# Altium project Fall22 Universal PCB Rev.2.PrjPcb (part 1 of 2)
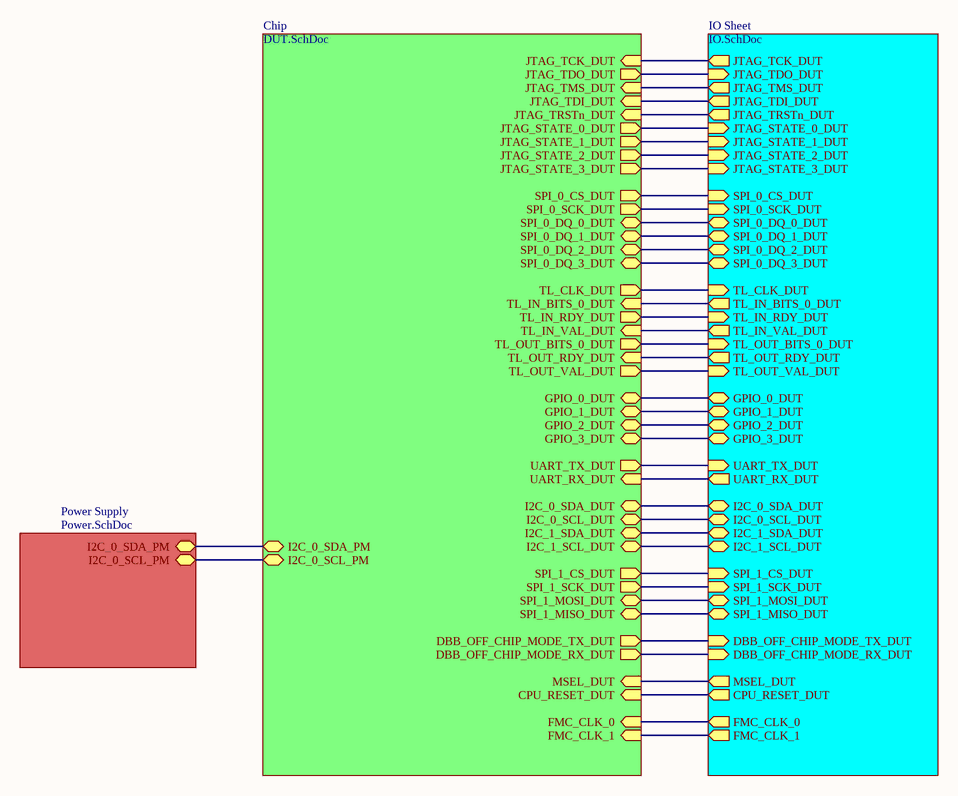
[diagram p0: Top.SchDoc]
4 sheets, 205 parts. Net scope: hierarchical (ports join the sheet entries above them; power ports are global).
Board file: PCB2.PcbDoc
Sheets:
  Top.SchDoc
    Chip = DUT.SchDoc
    Power Supply = Power.SchDoc
    IO Sheet = IO.SchDoc

## Sheet Top.SchDoc
size A

### Sub-sheets
Chip = DUT.SchDoc: JTAG_TCK_DUT (in), JTAG_TDO_DUT (out), JTAG_TMS_DUT (in), JTAG_TDI_DUT (in), JTAG_TRSTn_DUT (in), JTAG_STATE_0_DUT (out), JTAG_STATE_1_DUT (out), JTAG_STATE_2_DUT (out), JTAG_STATE_3_DUT (out), TL_CLK_DUT (out), SPI_0_CS_DUT (out), SPI_0_SCK_DUT (out), SPI_0_DQ_0_DUT (bidir), SPI_0_DQ_1_DUT (bidir), SPI_0_DQ_2_DUT (bidir), SPI_0_DQ_3_DUT (bidir), TL_IN_BITS_0_DUT (in), TL_IN_RDY_DUT (out), TL_IN_VAL_DUT (in), TL_OUT_BITS_0_DUT (out), TL_OUT_RDY_DUT (in), TL_OUT_VAL_DUT (out), GPIO_1_DUT (bidir), GPIO_0_DUT (bidir), GPIO_2_DUT (bidir), GPIO_3_DUT (bidir), UART_TX_DUT (out), UART_RX_DUT (in), I2C_0_SDA_DUT (bidir), I2C_0_SCL_DUT (bidir), I2C_1_SDA_DUT (bidir), I2C_1_SCL_DUT (bidir), SPI_1_CS_DUT (out), SPI_1_SCK_DUT (out), SPI_1_MOSI_DUT (bidir), SPI_1_MISO_DUT (bidir), DBB_OFF_CHIP_MODE_RX_DUT (out), DBB_OFF_CHIP_MODE_TX_DUT (out), I2C_0_SDA_PM (bidir), I2C_0_SCL_PM (bidir), MSEL_DUT (in), CPU_RESET_DUT (in), FMC_CLK_0 (in), FMC_CLK_1 (in)
IO Sheet = IO.SchDoc: JTAG_TCK_DUT (out), JTAG_TDO_DUT (in), JTAG_TMS_DUT (out), JTAG_TDI_DUT (out), JTAG_TRSTn_DUT (out), JTAG_STATE_0_DUT (in), JTAG_STATE_1_DUT (in), JTAG_STATE_2_DUT (in), JTAG_STATE_3_DUT (in), SPI_0_CS_DUT (in), SPI_0_SCK_DUT (in), SPI_0_DQ_0_DUT (bidir), SPI_0_DQ_1_DUT (bidir), SPI_0_DQ_2_DUT (bidir), SPI_0_DQ_3_DUT (bidir), TL_CLK_DUT (in), TL_IN_BITS_0_DUT (out), TL_IN_RDY_DUT (in), TL_IN_VAL_DUT (out), TL_OUT_BITS_0_DUT (in), TL_OUT_RDY_DUT (out), TL_OUT_VAL_DUT (in), GPIO_1_DUT (bidir), GPIO_0_DUT (bidir), GPIO_2_DUT (bidir), GPIO_3_DUT (bidir), UART_TX_DUT (in), UART_RX_DUT (out), I2C_0_SDA_DUT (bidir), I2C_0_SCL_DUT (bidir), I2C_1_SDA_DUT (bidir), I2C_1_SCL_DUT (bidir), SPI_1_CS_DUT (in), SPI_1_SCK_DUT (in), SPI_1_MOSI_DUT (bidir), SPI_1_MISO_DUT (bidir), DBB_OFF_CHIP_MODE_RX_DUT (in), DBB_OFF_CHIP_MODE_TX_DUT (in), MSEL_DUT (out), CPU_RESET_DUT (out), FMC_CLK_0 (out), FMC_CLK_1 (out)
Power Supply = Power.SchDoc: I2C_0_SDA_PM (bidir), I2C_0_SCL_PM (bidir)

### Nets
BOOT_SEL: sheet Chip/MSEL_DUT, sheet IO Sheet/MSEL_DUT
CPU_RESET: sheet Chip/CPU_RESET_DUT, sheet IO Sheet/CPU_RESET_DUT
DBB_OFF_CHIP_MODE_RX_DUT: sheet Chip/DBB_OFF_CHIP_MODE_RX_DUT, sheet IO Sheet/DBB_OFF_CHIP_MODE_RX_DUT
DBB_OFF_CHIP_MODE_TX_DUT: sheet Chip/DBB_OFF_CHIP_MODE_TX_DUT, sheet IO Sheet/DBB_OFF_CHIP_MODE_TX_DUT
GPIO_0: sheet Chip/GPIO_0_DUT, sheet IO Sheet/GPIO_0_DUT
GPIO_1: sheet Chip/GPIO_1_DUT, sheet IO Sheet/GPIO_1_DUT
GPIO_2: sheet Chip/GPIO_2_DUT, sheet IO Sheet/GPIO_2_DUT
GPIO_3: sheet Chip/GPIO_3_DUT, sheet IO Sheet/GPIO_3_DUT
I2C_0_SCL: sheet Chip/I2C_0_SCL_DUT, sheet IO Sheet/I2C_0_SCL_DUT
I2C_0_SCL_PM: sheet Chip/I2C_0_SCL_PM, sheet Power Supply/I2C_0_SCL_PM
I2C_0_SDA: sheet Chip/I2C_0_SDA_DUT, sheet IO Sheet/I2C_0_SDA_DUT
I2C_0_SDA_PM: sheet Chip/I2C_0_SDA_PM, sheet Power Supply/I2C_0_SDA_PM
I2C_1_SCL: sheet Chip/I2C_1_SCL_DUT, sheet IO Sheet/I2C_1_SCL_DUT
I2C_1_SDA: sheet Chip/I2C_1_SDA_DUT, sheet IO Sheet/I2C_1_SDA_DUT
JTAG_STATE_0: sheet Chip/JTAG_STATE_0_DUT, sheet IO Sheet/JTAG_STATE_0_DUT
JTAG_STATE_1: sheet Chip/JTAG_STATE_1_DUT, sheet IO Sheet/JTAG_STATE_1_DUT
JTAG_STATE_2: sheet Chip/JTAG_STATE_2_DUT, sheet IO Sheet/JTAG_STATE_2_DUT
JTAG_STATE_3: sheet Chip/JTAG_STATE_3_DUT, sheet IO Sheet/JTAG_STATE_3_DUT
JTAG_TCK: sheet Chip/JTAG_TCK_DUT, sheet IO Sheet/JTAG_TCK_DUT
JTAG_TDI: sheet Chip/JTAG_TDI_DUT, sheet IO Sheet/JTAG_TDI_DUT
JTAG_TDO: sheet Chip/JTAG_TDO_DUT, sheet IO Sheet/JTAG_TDO_DUT
JTAG_TMS: sheet Chip/JTAG_TMS_DUT, sheet IO Sheet/JTAG_TMS_DUT
JTAG_TRST: sheet Chip/JTAG_TRSTn_DUT, sheet IO Sheet/JTAG_TRSTn_DUT
SPI_0_CS: sheet Chip/SPI_0_CS_DUT, sheet IO Sheet/SPI_0_CS_DUT
SPI_0_DQ_0_DUT: sheet Chip/SPI_0_DQ_0_DUT, sheet IO Sheet/SPI_0_DQ_0_DUT
SPI_0_DQ_1_DUT: sheet Chip/SPI_0_DQ_1_DUT, sheet IO Sheet/SPI_0_DQ_1_DUT
SPI_0_DQ_2_DUT: sheet Chip/SPI_0_DQ_2_DUT, sheet IO Sheet/SPI_0_DQ_2_DUT
SPI_0_DQ_3_DUT: sheet Chip/SPI_0_DQ_3_DUT, sheet IO Sheet/SPI_0_DQ_3_DUT
SPI_0_SCK: sheet Chip/SPI_0_SCK_DUT, sheet IO Sheet/SPI_0_SCK_DUT
SPI_1_CS: sheet Chip/SPI_1_CS_DUT, sheet IO Sheet/SPI_1_CS_DUT
SPI_1_MISO: sheet Chip/SPI_1_MISO_DUT, sheet IO Sheet/SPI_1_MISO_DUT
SPI_1_MOSI: sheet Chip/SPI_1_MOSI_DUT, sheet IO Sheet/SPI_1_MOSI_DUT
SPI_1_SCK: sheet Chip/SPI_1_SCK_DUT, sheet IO Sheet/SPI_1_SCK_DUT
TL_CLK: sheet Chip/TL_CLK_DUT, sheet IO Sheet/TL_CLK_DUT
TL_IN_BITS_0_DUT: sheet Chip/TL_IN_BITS_0_DUT, sheet IO Sheet/TL_IN_BITS_0_DUT
TL_IN_RDY: sheet Chip/TL_IN_RDY_DUT, sheet IO Sheet/TL_IN_RDY_DUT
TL_IN_VAL: sheet Chip/TL_IN_VAL_DUT, sheet IO Sheet/TL_IN_VAL_DUT
TL_OUT_BITS_0_DUT: sheet Chip/TL_OUT_BITS_0_DUT, sheet IO Sheet/TL_OUT_BITS_0_DUT
TL_OUT_RDY: sheet Chip/TL_OUT_RDY_DUT, sheet IO Sheet/TL_OUT_RDY_DUT
TL_OUT_VAL: sheet Chip/TL_OUT_VAL_DUT, sheet IO Sheet/TL_OUT_VAL_DUT
UART_RX: sheet Chip/UART_RX_DUT, sheet IO Sheet/UART_RX_DUT
UART_TX: sheet Chip/UART_TX_DUT, sheet IO Sheet/UART_TX_DUT
NetH1_1: sheet Chip/FMC_CLK_1, sheet IO Sheet/FMC_CLK_1
NetH2_1: sheet Chip/FMC_CLK_0, sheet IO Sheet/FMC_CLK_0

## Sheet DUT.SchDoc
size A1; SPICEModelCacheEPBFKGZM: <root> / <DocumentId>EPBFKGZM</DocumentId> / </root>
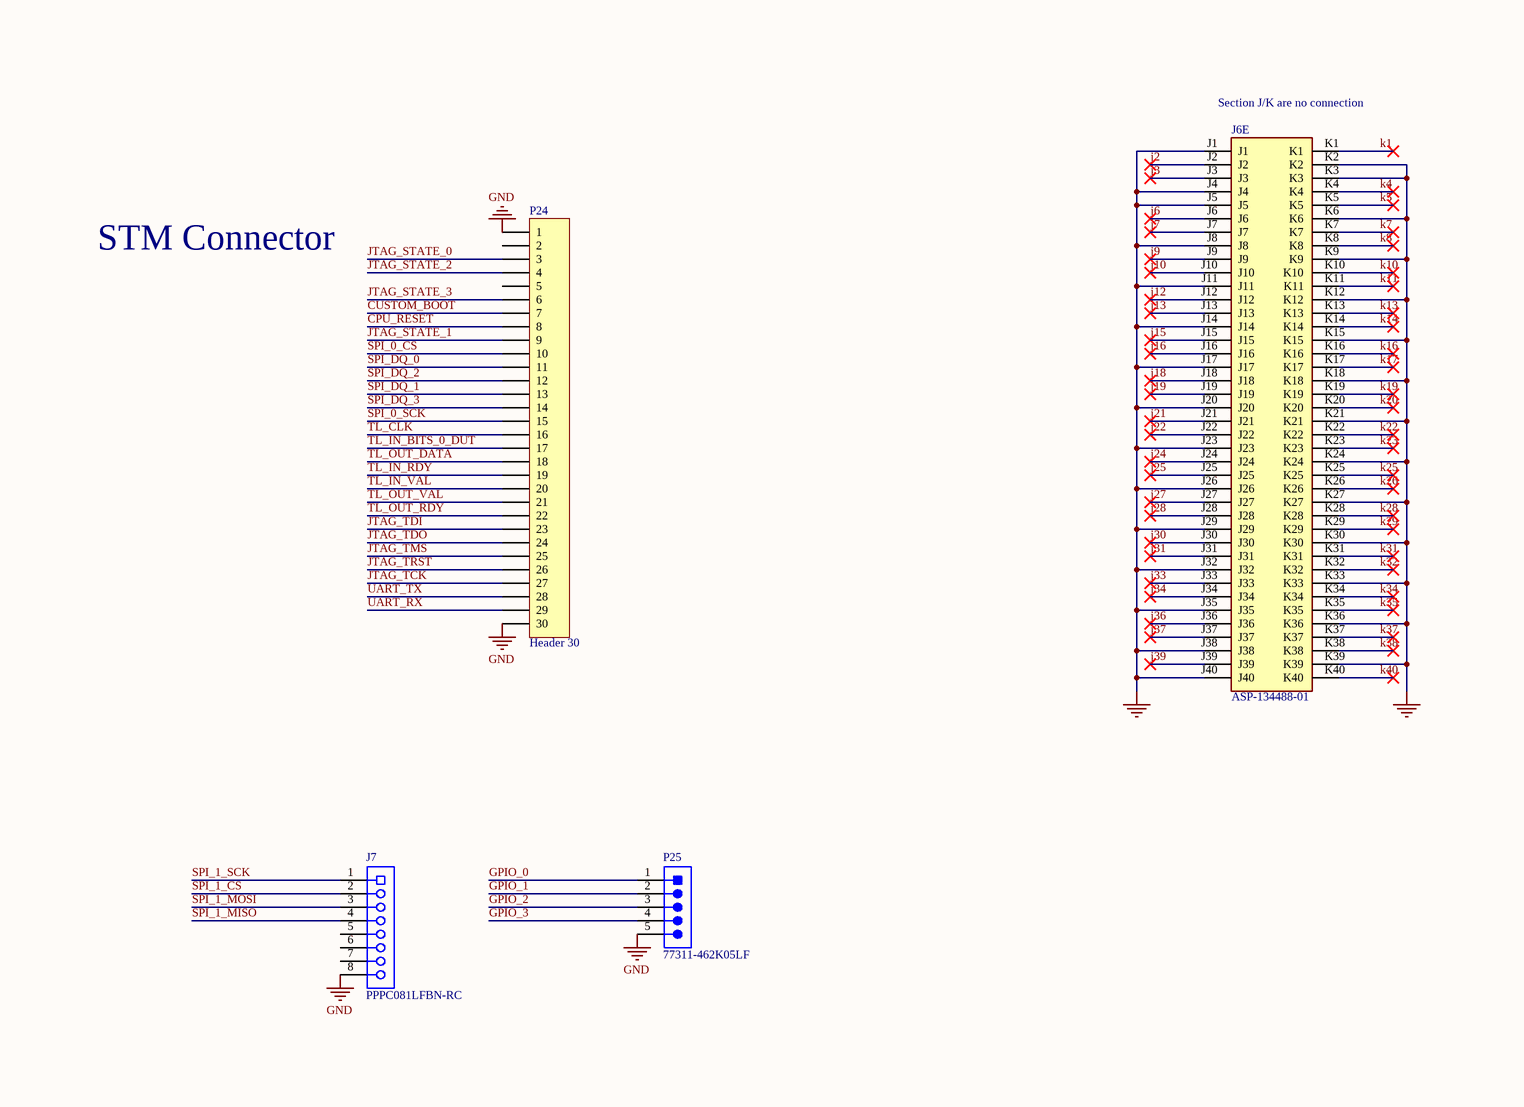
[diagram p1: DUT.SchDoc, centre left]
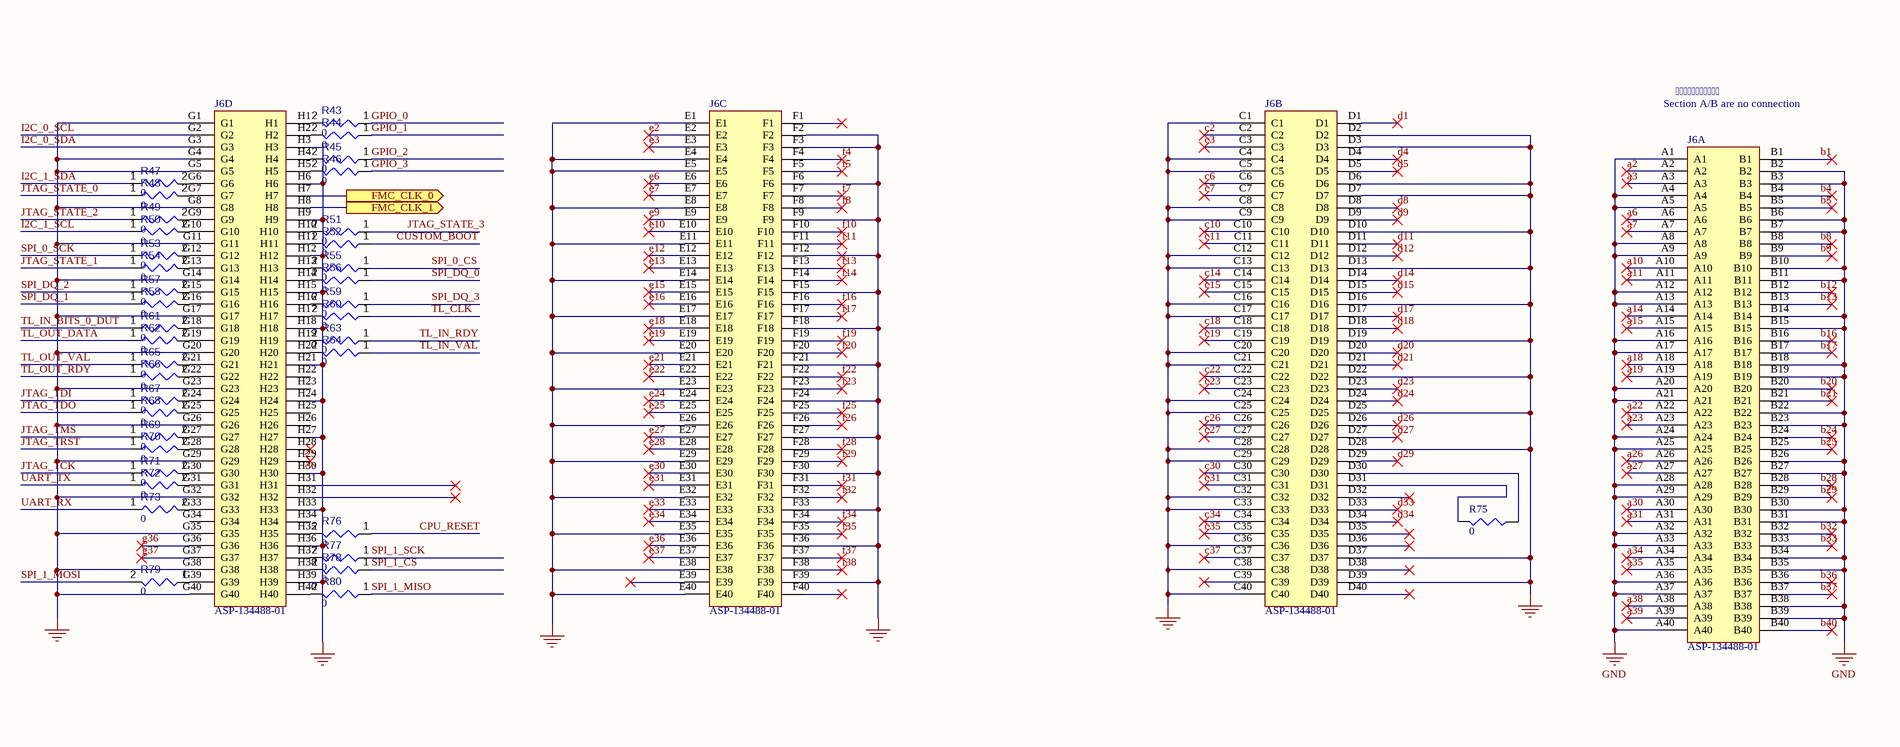
[diagram p2: DUT.SchDoc, centre right]
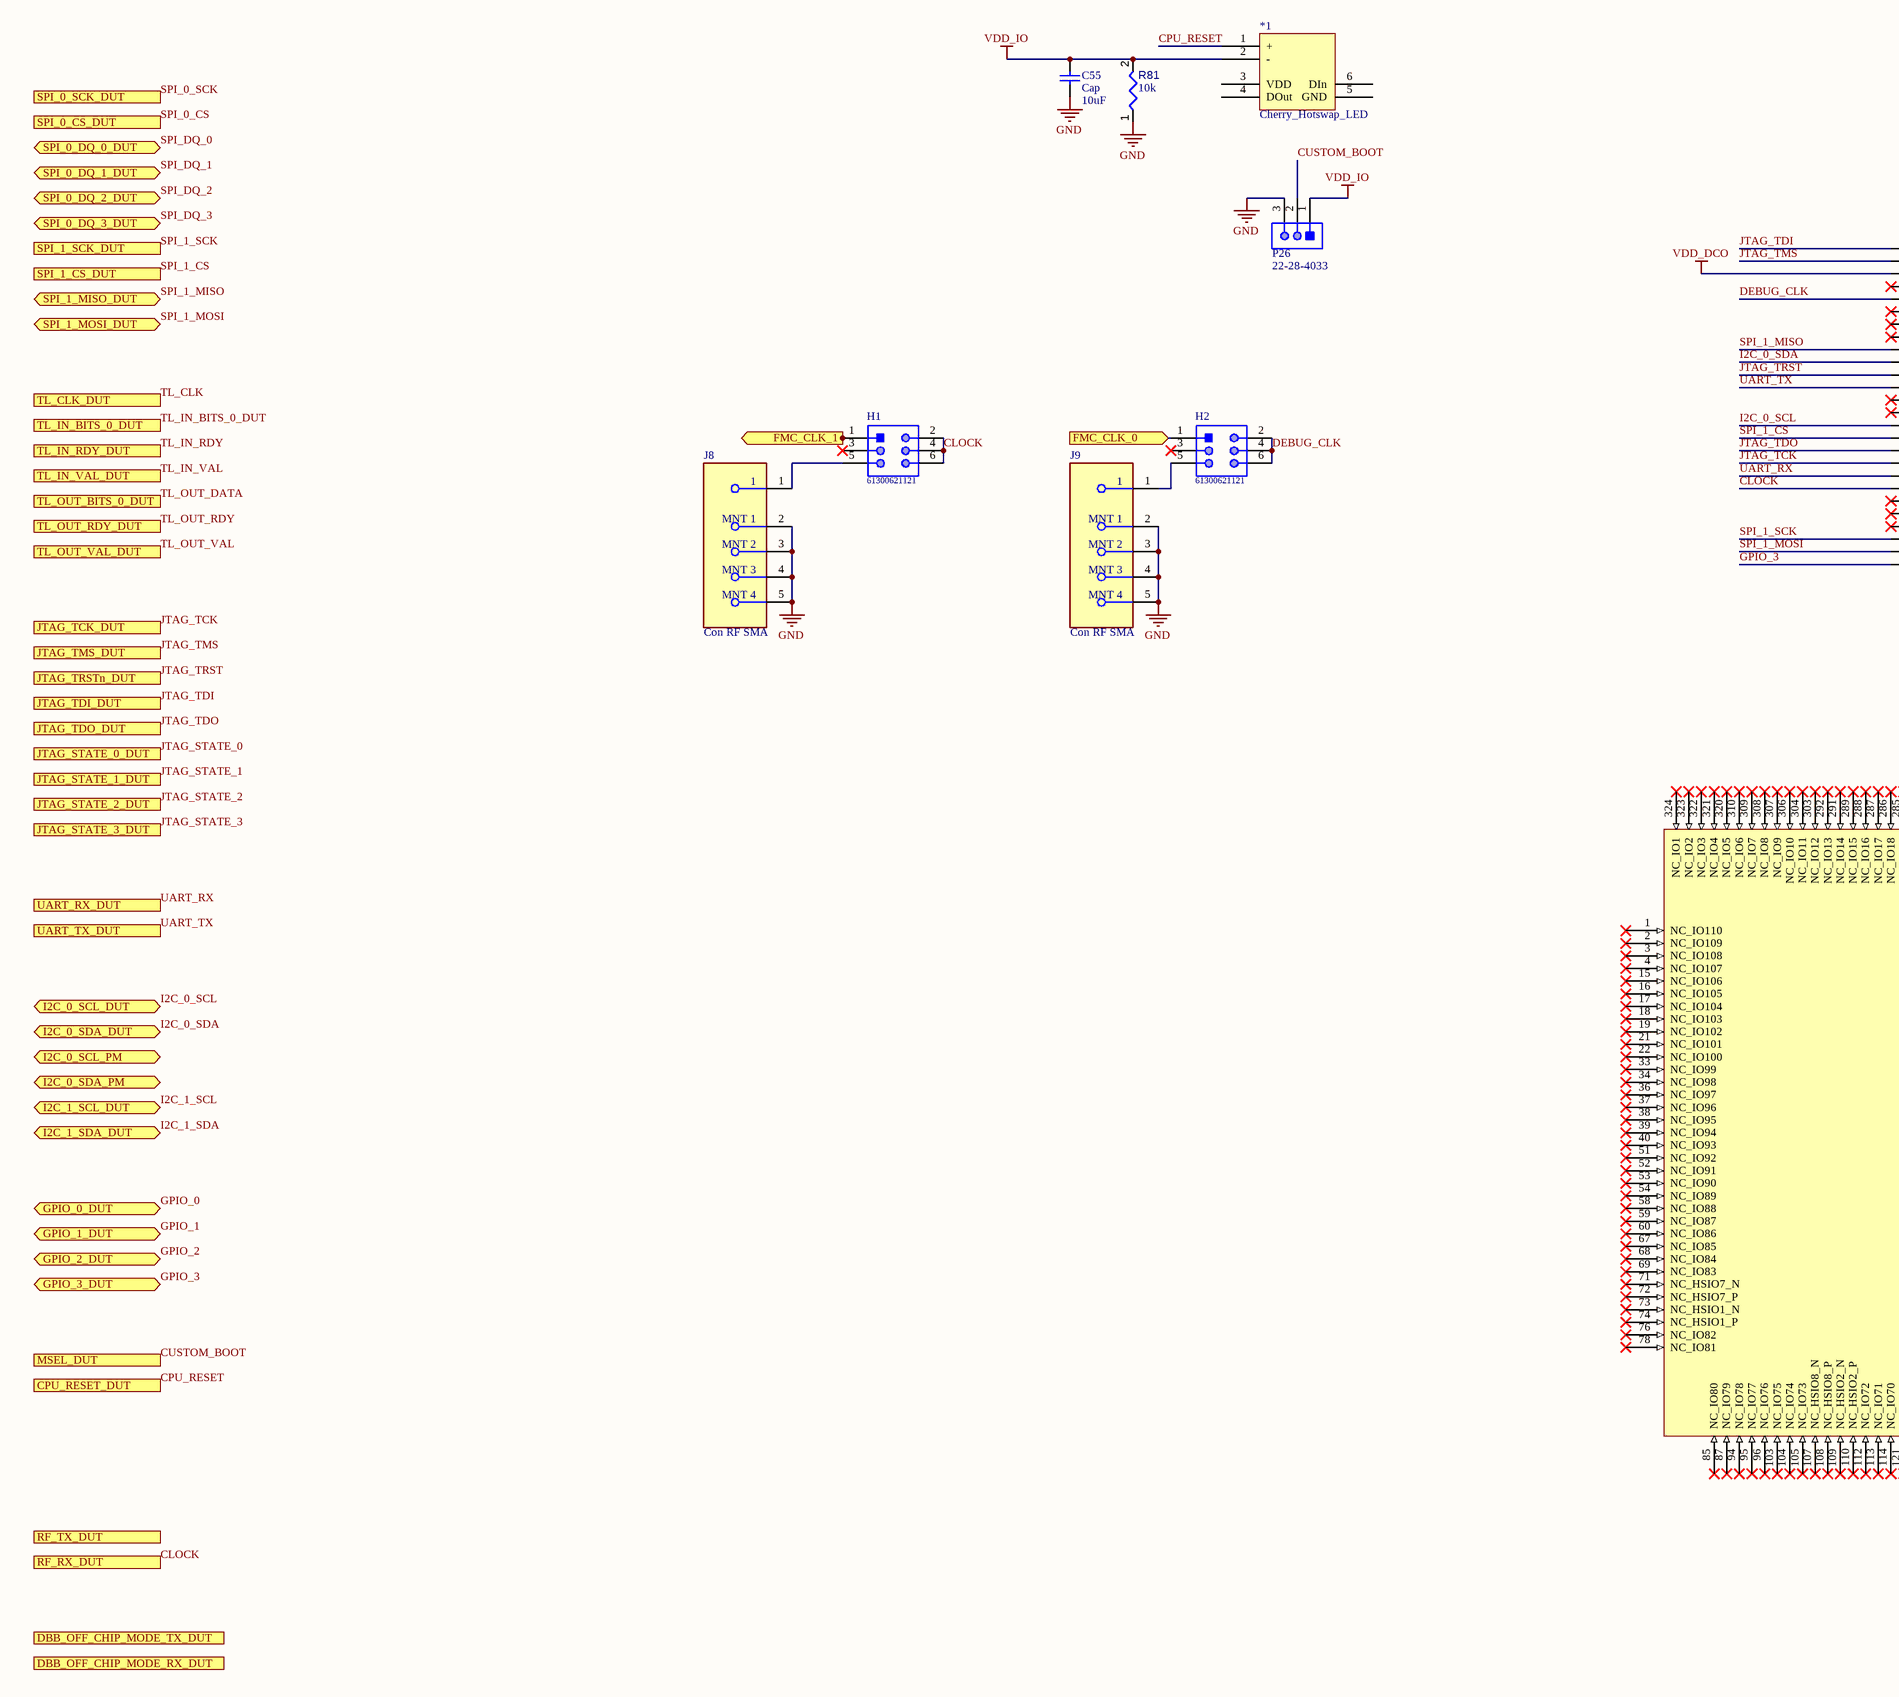
[diagram p3: DUT.SchDoc, bottom left]
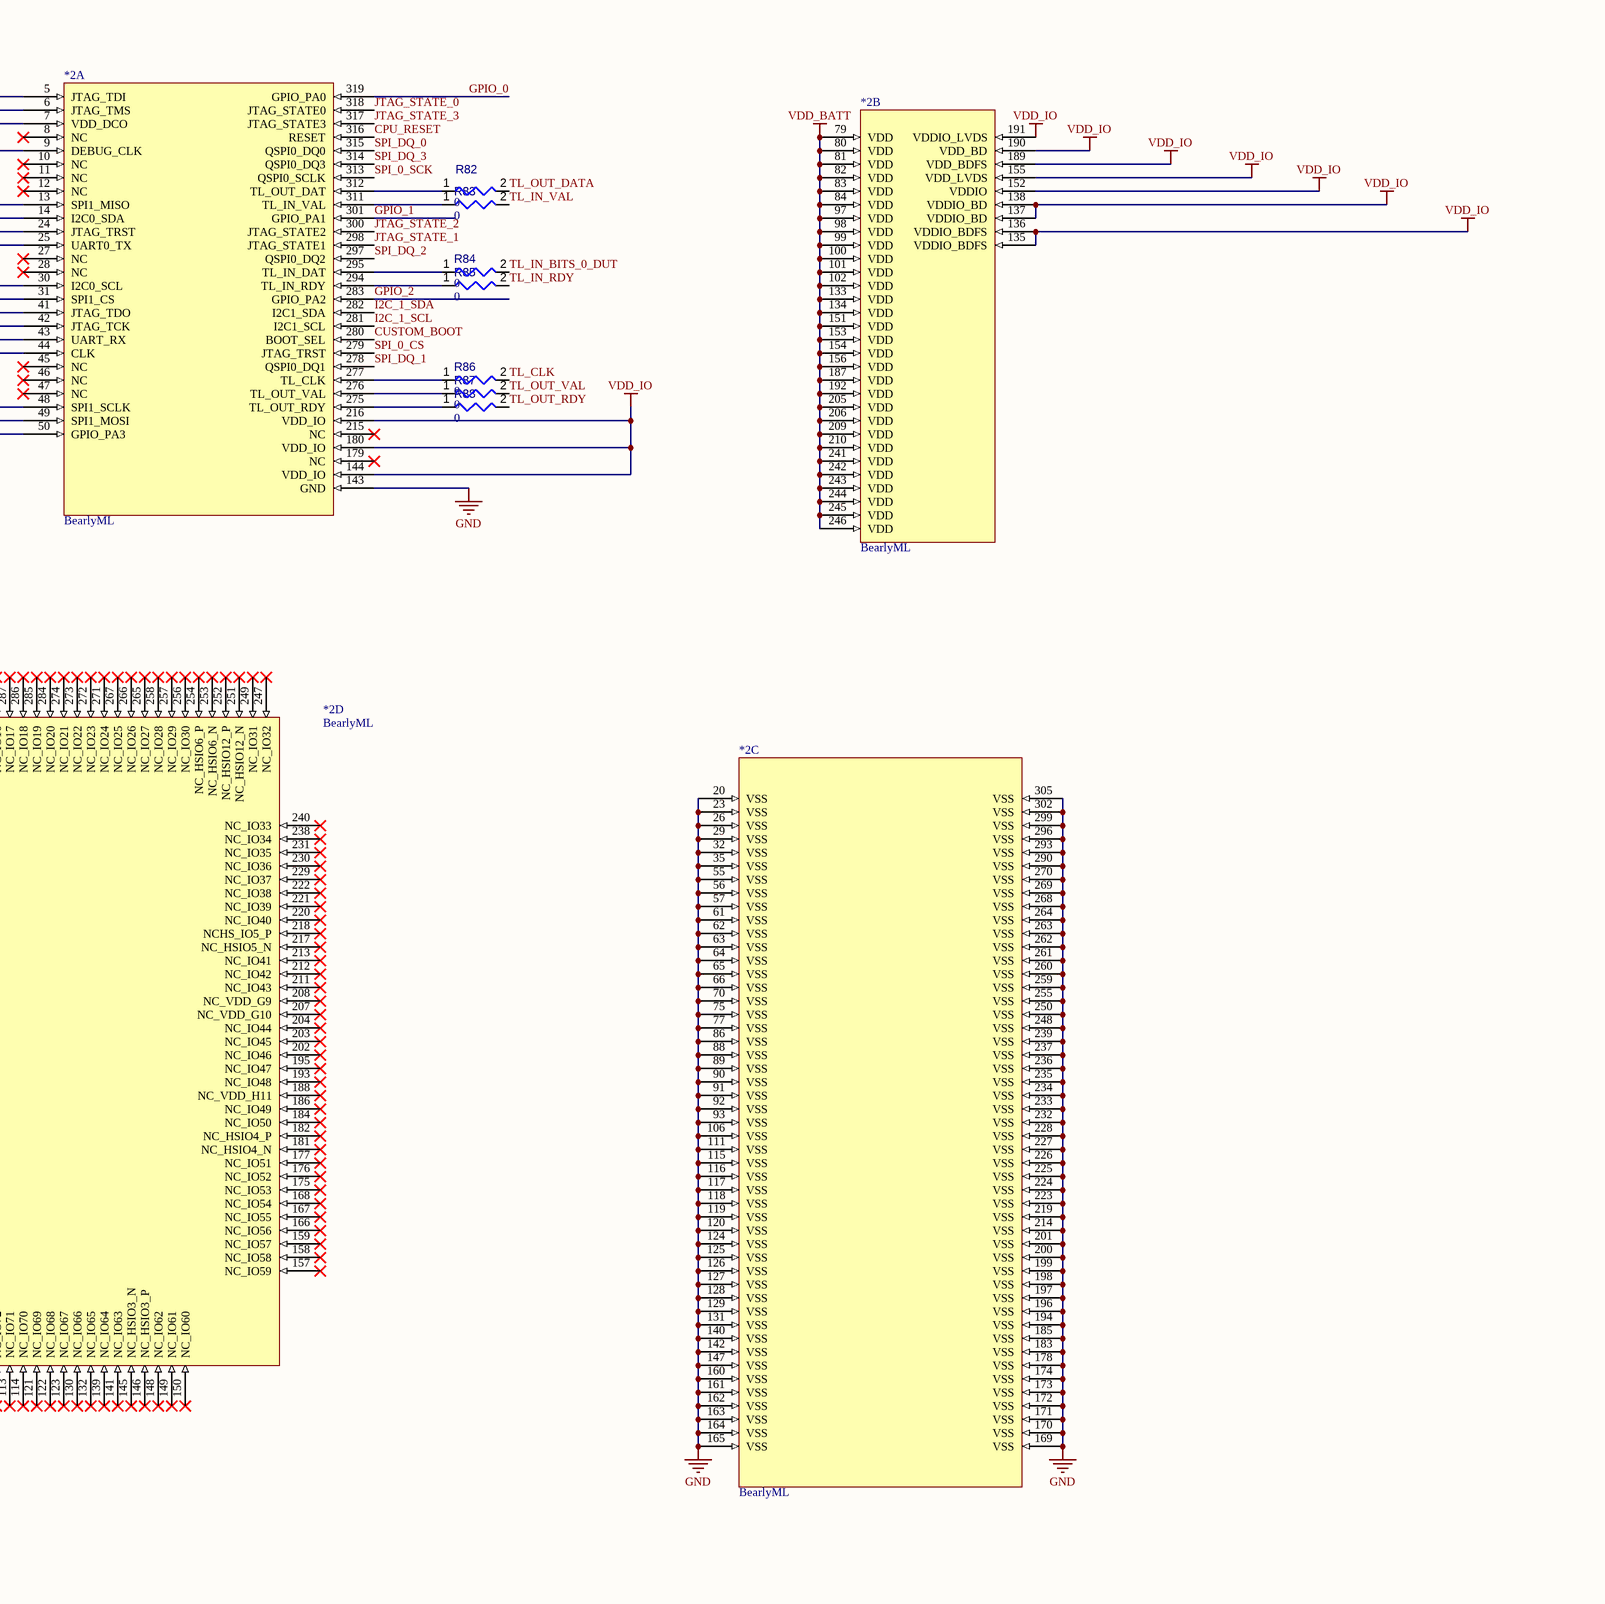
[diagram p4: DUT.SchDoc, bottom right]

### Parts
*1  Cherry_Hotswap_LED  [New footprint 1]
*2  BearlyML  [BGA324x18]  (parts A,B,C,D of 4)
C55  Cap  value 10uF  [0805]
H1  61300621121  [61300621121]
H2  61300621121  [61300621121]
J6  ASP-134488-01  [SAMTEC_ASP-134488-01]  (parts A,B,C,D,E of 5)
J7  PPPC081LFBN-RC  [SLIN-PPPC081LFBN-RC_V]
J8  Con RF SMA  [FP-RF2-04A-T-00-50-G-MFG]
J9  Con RF SMA  [FP-RF2-04A-T-00-50-G-MFG]
P24  Header 30  [HDR1X30]
P25  77311-462K05LF  [FCI-77311-5_V]
P26  22-28-4033  [MOLX-22-28-4033_V]
R43  value 0  [RESC0402(1005)_L]  (hidden comment: 0R2J)
R44  value 0  [RESC0402(1005)_L]  (hidden comment: 0R2J)
R45  value 0  [RESC0402(1005)_L]  (hidden comment: 0R2J)
R46  value 0  [RESC0402(1005)_L]  (hidden comment: 0R2J)
R47  value 0  [RESC0402(1005)_L]  (hidden comment: 0R2J)
R48  value 0  [RESC0402(1005)_L]  (hidden comment: 0R2J)
R49  value 0  [RESC0402(1005)_L]  (hidden comment: 0R2J)
R50  value 0  [RESC0402(1005)_L]  (hidden comment: 0R2J)
R51  value 0  [RESC0402(1005)_L]  (hidden comment: 0R2J)
R52  value 0  [RESC0402(1005)_L]  (hidden comment: 0R2J)
R53  value 0  [RESC0402(1005)_L]  (hidden comment: 0R2J)
R54  value 0  [RESC0402(1005)_L]  (hidden comment: 0R2J)
R55  value 0  [RESC0402(1005)_L]  (hidden comment: 0R2J)
R56  value 0  [RESC0402(1005)_L]  (hidden comment: 0R2J)
R57  value 0  [RESC0402(1005)_L]  (hidden comment: 0R2J)
R58  value 0  [RESC0402(1005)_L]  (hidden comment: 0R2J)
R59  value 0  [RESC0402(1005)_L]  (hidden comment: 0R2J)
R60  value 0  [RESC0402(1005)_L]  (hidden comment: 0R2J)
R61  value 0  [RESC0402(1005)_L]  (hidden comment: 0R2J)
R62  value 0  [RESC0402(1005)_L]  (hidden comment: 0R2J)
R63  value 0  [RESC0402(1005)_L]  (hidden comment: 0R2J)
R64  value 0  [RESC0402(1005)_L]  (hidden comment: 0R2J)
R65  value 0  [RESC0402(1005)_L]  (hidden comment: 0R2J)
R66  value 0  [RESC0402(1005)_L]  (hidden comment: 0R2J)
R67  value 0  [RESC0402(1005)_L]  (hidden comment: 0R2J)
R68  value 0  [RESC0402(1005)_L]  (hidden comment: 0R2J)
R69  value 0  [RESC0402(1005)_L]  (hidden comment: 0R2J)
R70  value 0  [RESC0402(1005)_L]  (hidden comment: 0R2J)
R71  value 0  [RESC0402(1005)_L]  (hidden comment: 0R2J)
R72  value 0  [RESC0402(1005)_L]  (hidden comment: 0R2J)
R73  value 0  [RESC0402(1005)_L]  (hidden comment: 0R2J)
R75  0  [0603]
R76  value 0  [RESC0402(1005)_L]  (hidden comment: 0R2J)
R77  value 0  [RESC0402(1005)_L]  (hidden comment: 0R2J)
R78  value 0  [RESC0402(1005)_L]  (hidden comment: 0R2J)
R79  value 0  [RESC0402(1005)_L]  (hidden comment: 0R2J)
R80  value 0  [RESC0402(1005)_L]  (hidden comment: 0R2J)
R81  value 10k  [RESC1608X55X25ML10T15]  (hidden comment: Resistor 10k +/-1% 0603 100 mW)
R82  value 0  [RESC0402(1005)_L]  (hidden comment: 0R2J)
R83  value 0  [RESC0402(1005)_L]  (hidden comment: 0R2J)
R84  value 0  [RESC0402(1005)_L]  (hidden comment: 0R2J)
R85  value 0  [RESC0402(1005)_L]  (hidden comment: 0R2J)
R86  value 0  [RESC0402(1005)_L]  (hidden comment: 0R2J)
R87  value 0  [RESC0402(1005)_L]  (hidden comment: 0R2J)
R88  value 0  [RESC0402(1005)_L]  (hidden comment: 0R2J)

### Ports
CPU_RESET_DUT (in), DBB_OFF_CHIP_MODE_RX_DUT (out), DBB_OFF_CHIP_MODE_TX_DUT (out), FMC_CLK_0 (in), FMC_CLK_0 (out), FMC_CLK_1 (out), GPIO_0_DUT (bidir), GPIO_1_DUT (bidir), GPIO_2_DUT (bidir), GPIO_3_DUT (bidir), I2C_0_SCL_DUT (bidir), I2C_0_SCL_PM (bidir), I2C_0_SDA_DUT (bidir), I2C_0_SDA_PM (bidir), I2C_1_SCL_DUT (bidir), I2C_1_SDA_DUT (bidir), JTAG_STATE_0_DUT (out), JTAG_STATE_1_DUT (out), JTAG_STATE_2_DUT (out), JTAG_STATE_3_DUT (out), JTAG_TCK_DUT (in), JTAG_TDI_DUT (in), JTAG_TDO_DUT (out), JTAG_TMS_DUT (in), JTAG_TRSTn_DUT (in), MSEL_DUT (out), RF_RX_DUT (in), RF_TX_DUT (out), SPI_0_CS_DUT (out), SPI_0_DQ_0_DUT (bidir), SPI_0_DQ_1_DUT (bidir), SPI_0_DQ_2_DUT (bidir), SPI_0_DQ_3_DUT (bidir), SPI_0_SCK_DUT (out), SPI_1_CS_DUT (out), SPI_1_MISO_DUT (bidir), SPI_1_MOSI_DUT (bidir), SPI_1_SCK_DUT (out), TL_CLK_DUT (out), TL_IN_BITS_0_DUT (in), TL_IN_RDY_DUT (out), TL_IN_VAL_DUT (in), TL_OUT_BITS_0_DUT (out), TL_OUT_RDY_DUT (in), TL_OUT_VAL_DUT (out), UART_RX_DUT (in), UART_TX_DUT (out)

### Nets
GND: *2.20(VSS) *2.23(VSS) *2.26(VSS) *2.29(VSS) *2.32(VSS) *2.35(VSS) *2.55(VSS) *2.56(VSS) *2.57(VSS) *2.61(VSS) *2.62(VSS) *2.63(VSS) *2.64(VSS) *2.65(VSS) *2.66(VSS) *2.70(VSS) *2.75(VSS) *2.77(VSS) *2.86(VSS) *2.88(VSS) *2.89(VSS) *2.90(VSS) *2.91(VSS) *2.92(VSS) *2.93(VSS) *2.106(VSS) *2.111(VSS) *2.115(VSS) *2.116(VSS) *2.117(VSS) *2.118(VSS) *2.119(VSS) *2.120(VSS) *2.124(VSS) *2.125(VSS) *2.126(VSS) *2.127(VSS) *2.128(VSS) *2.129(VSS) *2.131(VSS) *2.140(VSS) *2.142(VSS) *2.143(GND) *2.147(VSS) *2.160(VSS) *2.161(VSS) *2.162(VSS) *2.163(VSS) *2.164(VSS) *2.165(VSS) *2.169(VSS) *2.170(VSS) *2.171(VSS) *2.172(VSS) *2.173(VSS) *2.174(VSS) *2.178(VSS) *2.183(VSS) *2.185(VSS) *2.194(VSS) *2.196(VSS) *2.197(VSS) *2.198(VSS) *2.199(VSS) *2.200(VSS) *2.201(VSS) *2.214(VSS) *2.219(VSS) *2.223(VSS) *2.224(VSS) *2.225(VSS) *2.226(VSS) *2.227(VSS) *2.228(VSS) *2.232(VSS) *2.233(VSS) *2.234(VSS) *2.235(VSS) *2.236(VSS) *2.237(VSS) *2.239(VSS) *2.248(VSS) *2.250(VSS) *2.255(VSS) *2.259(VSS) *2.260(VSS) *2.261(VSS) *2.262(VSS) *2.263(VSS) *2.264(VSS) *2.268(VSS) *2.269(VSS) *2.270(VSS) *2.290(VSS) *2.293(VSS) *2.296(VSS) *2.299(VSS) *2.302(VSS) *2.305(VSS) C55.1 J6.A1 J6.A4 J6.A5 J6.A8 J6.A9 J6.A12 J6.A13 J6.A16 J6.A17 J6.A20 J6.A21 J6.A24 J6.A25 J6.A28 J6.A29 J6.A32 J6.A33 J6.A36 J6.A37 J6.A40 J6.B2 J6.B3 J6.B6 J6.B7 J6.B10 J6.B11 J6.B14 J6.B15 J6.B18 J6.B19 J6.B22 J6.B23 J6.B26 J6.B27 J6.B30 J6.B31 J6.B34 J6.B35 J6.B38 J6.B39 J6.C1 J6.C4 J6.C5 J6.C8 J6.C9 J6.C12 J6.C13 J6.C16 J6.C17 J6.C20 J6.C21 J6.C24 J6.C25 J6.C28 J6.C29 J6.C32 J6.C33 J6.C36 J6.C38 J6.C40 J6.D2 J6.D3 J6.D6 J6.D7 J6.D10 J6.D13 J6.D16 J6.D19 J6.D22 J6.D25 J6.D28 J6.D37 J6.D39 J6.E1 J6.E4 J6.E5 J6.E8 J6.E11 J6.E14 J6.E17 J6.E20 J6.E23 J6.E26 J6.E29 J6.E32 J6.E35 J6.E38 J6.E40 J6.F2 J6.F3 J6.F6 J6.F9 J6.F12 J6.F15 J6.F18 J6.F21 J6.F24 J6.F27 J6.F30 J6.F33 J6.F36 J6.F39 J6.G1 J6.G4 J6.G5 J6.G8 J6.G11 J6.G14 J6.G17 J6.G20 J6.G23 J6.G26 J6.G29 J6.G32 J6.G35 J6.G38 J6.G40 J6.H3 J6.H6 J6.H9 J6.H12 J6.H15 J6.H18 J6.H21 J6.H24 J6.H27 J6.H30 J6.H33 J6.H36 J6.H39 J6.J1 J6.J4 J6.J5 J6.J8 J6.J11 J6.J14 J6.J17 J6.J20 J6.J23 J6.J26 J6.J29 J6.J32 J6.J35 J6.J38 J6.J40 J6.K2 J6.K3 J6.K6 J6.K9 J6.K12 J6.K15 J6.K18 J6.K21 J6.K24 J6.K27 J6.K30 J6.K33 J6.K36 J6.K39 J7.8 J8.2(MNT_1) J8.3(MNT_2) J8.4(MNT_3) J8.5(MNT_4) J9.2(MNT_1) J9.3(MNT_2) J9.4(MNT_3) J9.5(MNT_4) P24.1 P24.30 P25.5(CTS) P26.3 R81.1
VDD_BATT: *2.79(VDD) *2.80(VDD) *2.81(VDD) *2.82(VDD) *2.83(VDD) *2.84(VDD) *2.97(VDD) *2.98(VDD) *2.99(VDD) *2.100(VDD) *2.101(VDD) *2.102(VDD) *2.133(VDD) *2.134(VDD) *2.151(VDD) *2.153(VDD) *2.154(VDD) *2.156(VDD) *2.187(VDD) *2.192(VDD) *2.205(VDD) *2.206(VDD) *2.209(VDD) *2.210(VDD) *2.241(VDD) *2.242(VDD) *2.243(VDD) *2.244(VDD) *2.245(VDD) *2.246(VDD)
VDD_DCO: *2.7(VDD_DCO)
VDD_IO: *1.2(-) *2.135(VDDIO_BDFS) *2.136(VDDIO_BDFS) *2.137(VDDIO_BD) *2.138(VDDIO_BD) *2.144(VDD_IO) *2.152(VDDIO) *2.155(VDD_LVDS) *2.180(VDD_IO) *2.189(VDD_BDFS) *2.190(VDD_BD) *2.191(VDDIO_LVDS) *2.216(VDD_IO) C55.2 P26.1 R81.2  [project net 1V8_DUT]
a2: J6.A2
a3: J6.A3
a6: J6.A6
a7: J6.A7
a10: J6.A10
a11: J6.A11
a14: J6.A14
a15: J6.A15
a18: J6.A18
a19: J6.A19
a22: J6.A22
a23: J6.A23
a26: J6.A26
a27: J6.A27
a30: J6.A30
a31: J6.A31
a34: J6.A34
a35: J6.A35
a38: J6.A38
a39: J6.A39
b1: J6.B1
b4: J6.B4
b5: J6.B5
b8: J6.B8
b9: J6.B9
b12: J6.B12
b13: J6.B13
b16: J6.B16
b17: J6.B17
b20: J6.B20
b21: J6.B21
b24: J6.B24
b25: J6.B25
b28: J6.B28
b29: J6.B29
b32: J6.B32
b33: J6.B33
b36: J6.B36
b37: J6.B37
b40: J6.B40
c2: J6.C2
c3: J6.C3
c6: J6.C6
c7: J6.C7
c10: J6.C10
c11: J6.C11
c14: J6.C14
c15: J6.C15
c18: J6.C18
c19: J6.C19
c22: J6.C22
c23: J6.C23
c26: J6.C26
c27: J6.C27
c30: J6.C30
c31: J6.C31
c34: J6.C34
c35: J6.C35
c37: J6.C37
CLOCK: *2.44(CLK) H1.2 H1.4 H1.6 ; port RF_RX_DUT
CPU_RESET: *1.1(+) *2.316(RESET) P24.8 R76.1 ; port CPU_RESET_DUT
CUSTOM_BOOT: *2.280(BOOT_SEL) P24.7 P26.2 R52.1 ; port MSEL_DUT  [project net BOOT_SEL]
d1: J6.D1
d4: J6.D4
d5: J6.D5
d8: J6.D8
d9: J6.D9
d11: J6.D11
d12: J6.D12
d14: J6.D14
d15: J6.D15
d17: J6.D17
d18: J6.D18
d20: J6.D20
d21: J6.D21
d23: J6.D23
d24: J6.D24
d26: J6.D26
d27: J6.D27
d29: J6.D29
d33: J6.D33
d34: J6.D34
DEBUG_CLK: *2.9(DEBUG_CLK) H2.2 H2.4 H2.6
e2: J6.E2
e3: J6.E3
e6: J6.E6
e7: J6.E7
e9: J6.E9
e10: J6.E10
e12: J6.E12
e13: J6.E13
e15: J6.E15
e16: J6.E16
e18: J6.E18
e19: J6.E19
e21: J6.E21
e22: J6.E22
e24: J6.E24
e25: J6.E25
e27: J6.E27
e28: J6.E28
e30: J6.E30
e31: J6.E31
e33: J6.E33
e34: J6.E34
e36: J6.E36
e37: J6.E37
f4: J6.F4
f5: J6.F5
f7: J6.F7
f8: J6.F8
f10: J6.F10
f11: J6.F11
f13: J6.F13
f14: J6.F14
f16: J6.F16
f17: J6.F17
f19: J6.F19
f20: J6.F20
f22: J6.F22
f23: J6.F23
f25: J6.F25
f26: J6.F26
f28: J6.F28
f29: J6.F29
f31: J6.F31
f32: J6.F32
f34: J6.F34
f35: J6.F35
f37: J6.F37
f38: J6.F38
g36: J6.G36
g37: J6.G37
GPIO_0: *2.319(GPIO_PA0) P25.1(DTR) R43.1 ; port GPIO_0_DUT
GPIO_1: *2.301(GPIO_PA1) P25.2(RXI) R44.1 ; port GPIO_1_DUT
GPIO_2: *2.283(GPIO_PA2) P25.3(TXO) R45.1 ; port GPIO_2_DUT
GPIO_3: *2.50(GPIO_PA3) P25.4(VCC) R46.1 ; port GPIO_3_DUT
I2C_0_SCL: *2.30(I2C0_SCL) J6.G2 ; port I2C_0_SCL_DUT
I2C_0_SDA: *2.14(I2C0_SDA) J6.G3 ; port I2C_0_SDA_DUT
I2C_1_SCL: *2.281(I2C1_SCL) R50.1 ; port I2C_1_SCL_DUT
I2C_1_SDA: *2.282(I2C1_SDA) R47.1 ; port I2C_1_SDA_DUT
j2: J6.J2
j3: J6.J3
j6: J6.J6
j7: J6.J7
j9: J6.J9
j10: J6.J10
j12: J6.J12
j13: J6.J13
j15: J6.J15
j16: J6.J16
j18: J6.J18
j19: J6.J19
j21: J6.J21
j22: J6.J22
j24: J6.J24
j25: J6.J25
j27: J6.J27
j28: J6.J28
j30: J6.J30
j31: J6.J31
j33: J6.J33
j34: J6.J34
j36: J6.J36
j37: J6.J37
j39: J6.J39
JTAG_STATE_0: *2.318(JTAG_STATE0) P24.3 R48.1 ; port JTAG_STATE_0_DUT
JTAG_STATE_1: *2.298(JTAG_STATE1) P24.9 R54.1 ; port JTAG_STATE_1_DUT
JTAG_STATE_2: *2.300(JTAG_STATE2) P24.4 R49.1 ; port JTAG_STATE_2_DUT
JTAG_STATE_3: *2.317(JTAG_STATE3) P24.6 R51.1 ; port JTAG_STATE_3_DUT
JTAG_TCK: *2.42(JTAG_TCK) P24.27 R71.1 ; port JTAG_TCK_DUT
JTAG_TDI: *2.5(JTAG_TDI) P24.23 R67.1 ; port JTAG_TDI_DUT
JTAG_TDO: *2.41(JTAG_TDO) P24.24 R68.1 ; port JTAG_TDO_DUT
JTAG_TMS: *2.6(JTAG_TMS) P24.25 R69.1 ; port JTAG_TMS_DUT
JTAG_TRST: *2.24(JTAG_TRST) P24.26 R70.1 ; port JTAG_TRSTn_DUT
k1: J6.K1
k4: J6.K4
k5: J6.K5
k7: J6.K7
k8: J6.K8
k10: J6.K10
k11: J6.K11
k13: J6.K13
k14: J6.K14
k16: J6.K16
k17: J6.K17
k19: J6.K19
k20: J6.K20
k22: J6.K22
k23: J6.K23
k25: J6.K25
k26: J6.K26
k28: J6.K28
k29: J6.K29
k31: J6.K31
k32: J6.K32
k34: J6.K34
k35: J6.K35
k37: J6.K37
k38: J6.K38
k40: J6.K40
SPI_0_CS: *2.279(JTAG_TRST) P24.10 R55.1 ; port SPI_0_CS_DUT
SPI_0_SCK: *2.313(QSPI0_SCLK) P24.15 R53.1 ; port SPI_0_SCK_DUT
SPI_1_CS: *2.31(SPI1_CS) J7.2 R78.1 ; port SPI_1_CS_DUT
SPI_1_MISO: *2.13(SPI1_MISO) J7.4 R80.1 ; port SPI_1_MISO_DUT
SPI_1_MOSI: *2.49(SPI1_MOSI) J7.3 R79.2 ; port SPI_1_MOSI_DUT
SPI_1_SCK: *2.48(SPI1_SCLK) J7.1 R77.1 ; port SPI_1_SCK_DUT
SPI_DQ_0: *2.315(QSPI0_DQ0) P24.11 R56.1 ; port SPI_0_DQ_0_DUT  [project net SPI_0_DQ_0_DUT]
SPI_DQ_1: *2.278(QSPI0_DQ1) P24.13 R58.1 ; port SPI_0_DQ_1_DUT  [project net SPI_0_DQ_1_DUT]
SPI_DQ_2: *2.297(QSPI0_DQ2) P24.12 R57.1 ; port SPI_0_DQ_2_DUT  [project net SPI_0_DQ_2_DUT]
SPI_DQ_3: *2.314(QSPI0_DQ3) P24.14 R59.1 ; port SPI_0_DQ_3_DUT  [project net SPI_0_DQ_3_DUT]
TL_CLK: P24.16 R60.1 R86.2 ; port TL_CLK_DUT
TL_IN_BITS_0_DUT: P24.17 R61.1 R84.2 ; port TL_IN_BITS_0_DUT
TL_IN_RDY: P24.19 R63.1 R85.2 ; port TL_IN_RDY_DUT
TL_IN_VAL: P24.20 R64.1 R83.2 ; port TL_IN_VAL_DUT
TL_OUT_DATA: P24.18 R62.1 R82.2 ; port TL_OUT_BITS_0_DUT  [project net TL_OUT_BITS_0_DUT]
TL_OUT_RDY: P24.22 R66.1 R88.2 ; port TL_OUT_RDY_DUT
TL_OUT_VAL: P24.21 R65.1 R87.2 ; port TL_OUT_VAL_DUT
UART_RX: *2.43(UART_RX) P24.29 R73.1 ; port UART_RX_DUT
UART_TX: *2.25(UART0_TX) P24.28 R72.1 ; port UART_TX_DUT
Net*2_275: *2.275(TL_OUT_RDY) R88.1
Net*2_276: *2.276(TL_OUT_VAL) R87.1
Net*2_277: *2.277(TL_CLK) R86.1
Net*2_294: *2.294(TL_IN_RDY) R85.1
Net*2_295: *2.295(TL_IN_DAT) R84.1
Net*2_311: *2.311(TL_IN_VAL) R83.1
Net*2_312: *2.312(TL_OUT_DAT) R82.1
NetH1_1: H1.1 J6.H8 ; port FMC_CLK_1
NetH1_5: H1.5 J8.1
NetH2_1: H2.1 J6.H7 ; port FMC_CLK_0
NetH2_5: H2.5 J9.1
NetJ6_D30: J6.D30 R75.2
NetJ6_D31: J6.D31 R75.1
NetJ6_G6: J6.G6 R47.2
NetJ6_G7: J6.G7 R48.2
NetJ6_G9: J6.G9 R49.2
NetJ6_G10: J6.G10 R50.2
NetJ6_G12: J6.G12 R53.2
NetJ6_G13: J6.G13 R54.2
NetJ6_G15: J6.G15 R57.2
NetJ6_G16: J6.G16 R58.2
NetJ6_G18: J6.G18 R61.2
NetJ6_G19: J6.G19 R62.2
NetJ6_G21: J6.G21 R65.2
NetJ6_G22: J6.G22 R66.2
NetJ6_G24: J6.G24 R67.2
NetJ6_G25: J6.G25 R68.2
NetJ6_G27: J6.G27 R69.2
NetJ6_G28: J6.G28 R70.2
NetJ6_G30: J6.G30 R71.2
NetJ6_G31: J6.G31 R72.2
NetJ6_G33: J6.G33 R73.2
NetJ6_G39: J6.G39 R79.1
NetJ6_H1: J6.H1 R43.2
NetJ6_H2: J6.H2 R44.2
NetJ6_H4: J6.H4 R45.2
NetJ6_H5: J6.H5 R46.2
NetJ6_H10: J6.H10 R51.2
NetJ6_H11: J6.H11 R52.2
NetJ6_H13: J6.H13 R55.2
NetJ6_H14: J6.H14 R56.2
NetJ6_H16: J6.H16 R59.2
NetJ6_H17: J6.H17 R60.2
NetJ6_H19: J6.H19 R63.2
NetJ6_H20: J6.H20 R64.2
NetJ6_H35: J6.H35 R76.2
NetJ6_H37: J6.H37 R77.2
NetJ6_H38: J6.H38 R78.2
NetJ6_H40: J6.H40 R80.2

Not connected (* = marked no-connect by the designer): *1 3(VDD) 4(DOut) 5(GND) 6(DIn); *2 1(NC_IO110)* 2(NC_IO109)* 3(NC_IO108)* 4(NC_IO107)* 8(NC)* 10(NC)* 11(NC)* 12(NC)* 15(NC_IO106)* 16(NC_IO105)* 17(NC_IO104)* 18(NC_IO103)* 19(NC_IO102)* 21(NC_IO101)* 22(NC_IO100)* 27(NC)* 28(NC)* 33(NC_IO99)* 34(NC_IO98)* 36(NC_IO97)* 37(NC_IO96)* 38(NC_IO95)* 39(NC_IO94)* 40(NC_IO93)* 45(NC)* 46(NC)* 47(NC)* 51(NC_IO92)* 52(NC_IO91)* 53(NC_IO90)* 54(NC_IO89)* 58(NC_IO88)* 59(NC_IO87)* 60(NC_IO86)* 67(NC_IO85)* 68(NC_IO84)* 69(NC_IO83)* 71(NC_HSIO7_N)* 72(NC_HSIO7_P)* 73(NC_HSIO1_N)* 74(NC_HSIO1_P)* 76(NC_IO82)* 78(NC_IO81)* 85(NC_IO80)* 87(NC_IO79)* 94(NC_IO78)* 95(NC_IO77)* 96(NC_IO76)* 103(NC_IO75)* 104(NC_IO74)* 105(NC_IO73)* 107(NC_HSIO8_N)* 108(NC_HSIO8_P)* 109(NC_HSIO2_N)* 110(NC_HSIO2_P)* 112(NC_IO72)* 113(NC_IO71)* 114(NC_IO70)* 121(NC_IO69)* 122(NC_IO68)* 123(NC_IO67)* 130(NC_IO66)* 132(NC_IO65)* 139(NC_IO64)* 141(NC_IO63)* 145(NC_HSIO3_N)* 146(NC_HSIO3_P)* 148(NC_IO62)* 149(NC_IO61)* 150(NC_IO60)* 157(NC_IO59)* 158(NC_IO58)* 159(NC_IO57)* 166(NC_IO56)* 167(NC_IO55)* 168(NC_IO54)* 175(NC_IO53)* 176(NC_IO52)* 177(NC_IO51)* 179(NC)* 181(NC_HSIO4_N)* 182(NC_HSIO4_P)* 184(NC_IO50)* 186(NC_IO49)* 188(NC_VDD_H11)* 193(NC_IO48)* 195(NC_IO47)* 202(NC_IO46)* 203(NC_IO45)* 204(NC_IO44)* 207(NC_VDD_G10)* 208(NC_VDD_G9)* 211(NC_IO43)* 212(NC_IO42)* 213(NC_IO41)* 215(NC)* 217(NC_HSIO5_N)* 218(NCHS_IO5_P)* 220(NC_IO40)* 221(NC_IO39)* 222(NC_IO38)* 229(NC_IO37)* 230(NC_IO36)* 231(NC_IO35)* 238(NC_IO34)* 240(NC_IO33)* 247(NC_IO32)* 249(NC_IO31)* 251(NC_HSIO12_N)* 252(NC_HSIO12_P)* 253(NC_HSIO6_N)* 254(NC_HSIO6_P)* 256(NC_IO30)* 257(NC_IO29)* 258(NC_IO28)* 265(NC_IO27)* 266(NC_IO26)* 267(NC_IO25)* 271(NC_IO24)* 272(NC_IO23)* 273(NC_IO22)* 274(NC_IO21)* 284(NC_IO20)* 285(NC_IO19)* 286(NC_IO18)* 287(NC_IO17)* 288(NC_IO16)* 289(NC_IO15)* 291(NC_IO14)* 292(NC_IO13)* 303(NC_IO12)* 304(NC_IO11)* 306(NC_IO10)* 307(NC_IO9)* 308(NC_IO8)* 309(NC_IO7)* 310(NC_IO6)* 320(NC_IO5)* 321(NC_IO4)* 322(NC_IO3)* 323(NC_IO2)* 324(NC_IO1)*; H1 3*; H2 3*; J6 C39* D32* D35* D36* D38* D40* E39* F1* F40* G34 H22 H23 H25 H26 H28* H29* H31* H32* H34; J7 5 6 7; P24 2 5

### Notes on the sheet
- (near J6) Section J/K are no connection
- Section A/B are no connection
- 
- STM Connector

### Library data of the parts
*1 = CMP-00028-00007-1
*2 = BearlyML-2: BearlyML chip from Sp22 Tapeout class
C55 = Cap: Capacitor; Published: 8-Jun-2000; LatestRevisionDate: 17-Jul-2002; LatestRevisionNote: Re-released for DXP Platform.; PackageReference: RAD-0.3; Publisher: Altium Limited; PackageDescription: Radial Cap, Thru-Hole; 2 Leads; 0.3 in Pin Spacing
H1 H2 = CMP-1502-01072-1: THT Vertical Pin Header WR-PHD, Pitch 2.54 mm, Dual Row, 6 pins; Manufacturer: Wurth Elektronik; Contact Resistance: 20mOhm; Withstanding Voltage: 500VAC; Pin Number: 6; Gender: Male; Pitch: 2.54mm; Working Voltage: 250VAC; Rated Current: 3A; Packaging: Bag; Row Number: Dual; Manufacturer URL: http://www.we-online.de; Part Number: 61300621121; Operating Temperature: -40to105degC; Mounting Technology: THT; Package Reference: 61300621121; Datasheet URL: https://katalog.we-online.de/em/datasheet/6130xx21121.pdf; Orientation: Vertical; Publisher: WurthElektronik
J6 = CMP-013-000000-2: Board-To-Board Connector, Vita 57 XMC, ASP Series, Surface Mount, Header, 400, 1.27 mm; Source: ASP-134488-01.SchLib; MP: ASP-134488-01; Package: None; Component Type: Standard; Availability: Unavailable; Design Item ID: ASP-134488-01; Value: *; Price: None; Pin Count: 400
J7 = CMP-002-00028-2: Female Header, Pitch 2.54 mm, 1 x 8 Position, Height 8.5 mm, Tail Length 3.2 mm, -40 to 105 degC, RoHS, Bulk; Manufacturer: Sullins; Package Reference: PPPC081LFBN-RC; Connector Type: Header; Datasheet Version: Jan-15; Package Description: Female Header, Pitch 2.54 mm, 1 x 8 Position, Height 8.5 mm, Tail Length 3.2 mm; RoHS Compliant: Unknown; Max Operating Temperature: 105°C; Case/Package: PPPC081LFBN-RC; Min Operating Temperature: -40°C; Datasheet URL: http://sullinscorp.com/catalogs/101_PAGE114-115_.100_FEMALE_HDR.pdf; Gender: Female; Mounting Technology: TH
J8 J9 = CMP-42753-000002-1: CONN SMA JACK STR 50 OHM PCB
P24 = Header 30: Header, 30-Pin; LatestRevisionDate: 17-Jul-2002; LatestRevisionNote: Re-released for DXP Platform.; Publisher: Altium Limited
P25 = CMP-002-00021-2: Male Header, Pitch 2.54 mm, 1 x 5 Position, Height 16.24 mm, Tail Length 3.05 mm, -65 to 125 degC, RoHS, Tape and Reel; Manufacturer: FCI Electronics; Connector Type: Header; Manufacturer URL: http://portal.fciconnect.com/; Datasheet URL: http://portal.fciconnect.com/Comergent//fci/drawing/77311.pdf; Gender: Male; Case/Package: 77311-5; Package Reference: 77311-5; Datasheet Version: Rev. CK, 07/2016; Package Description: Male Header, Pitch 2.54 mm, 1 x 5 Position, Height 16.24 mm, Tail Length 3.05 mm; RoHS Compliant: Unknown; Mounting Technology: TH
P26 = CMP-1676-00001-5: Male Header, Pitch 2.54 mm, 1 x 3 Position, Height 8.38 mm, Tail Length 3.18 mm, RoHS, Bulk; Manufacturer: Molex; Rows: 1; Voltage Rating: 250 V; Current Rating: 4 A; Min Operating Temperature: 0 degC; Lead Pitch: 0.1 inch; Packaging: Bulk; Contact Finish: Gold; RoHSCompliant: true; Contact Material: Brass; PackageReference: 22-28-4033; REACH SVHC: Unknown; PackageDescription: Male Header, Pitch 2.54 mm, 1 x 3 Position, Height 8.38 mm, Tail Length 3.18 mm; ComponentLink2URL: http://www.molex.com/pdm_docs/sd/022284033_sd.pdf; Height: 8.38 mm; Mounting Technology: Through Hole; ComponentLink1Description: Manufacturer URL; Length: 7.62 mm; Mount: Through Hole; DatasheetVersion: Rev. G, 01/2012; Max Operating Temperature: 75 degC; ComponentLink2Description: Datasheet; Colour: Black; Pins: 3; Contact Plating: Gold; Package Quantity: 1; ComponentLink1URL: http://www.molex.com/
R43-R73 R76-R80 R82-R88 = CMP-009-00062-2: Jumper 0402 (1005 Metric); Pins: 2; Mounting Technology: SMT; Case/Package: 0402
R75 = DISCRETE_R: 0 0603
R81 = CMP-009-00017-5: Chip Resistor, 10 KOhm, +/- 1%, 01 W, -55 to 155 degC, 0603 (1608 Metric); Voltage Rating: 50V; Power: 100mW; RoHS Compliant: True; Min Operating Temperature: -55°C; Pins: 2; Case/Package: 0603; Mounting Technology: SM; Max Operating Temperature: 155°C; Tolerance: 1%

## Sheet Power.SchDoc
size A2
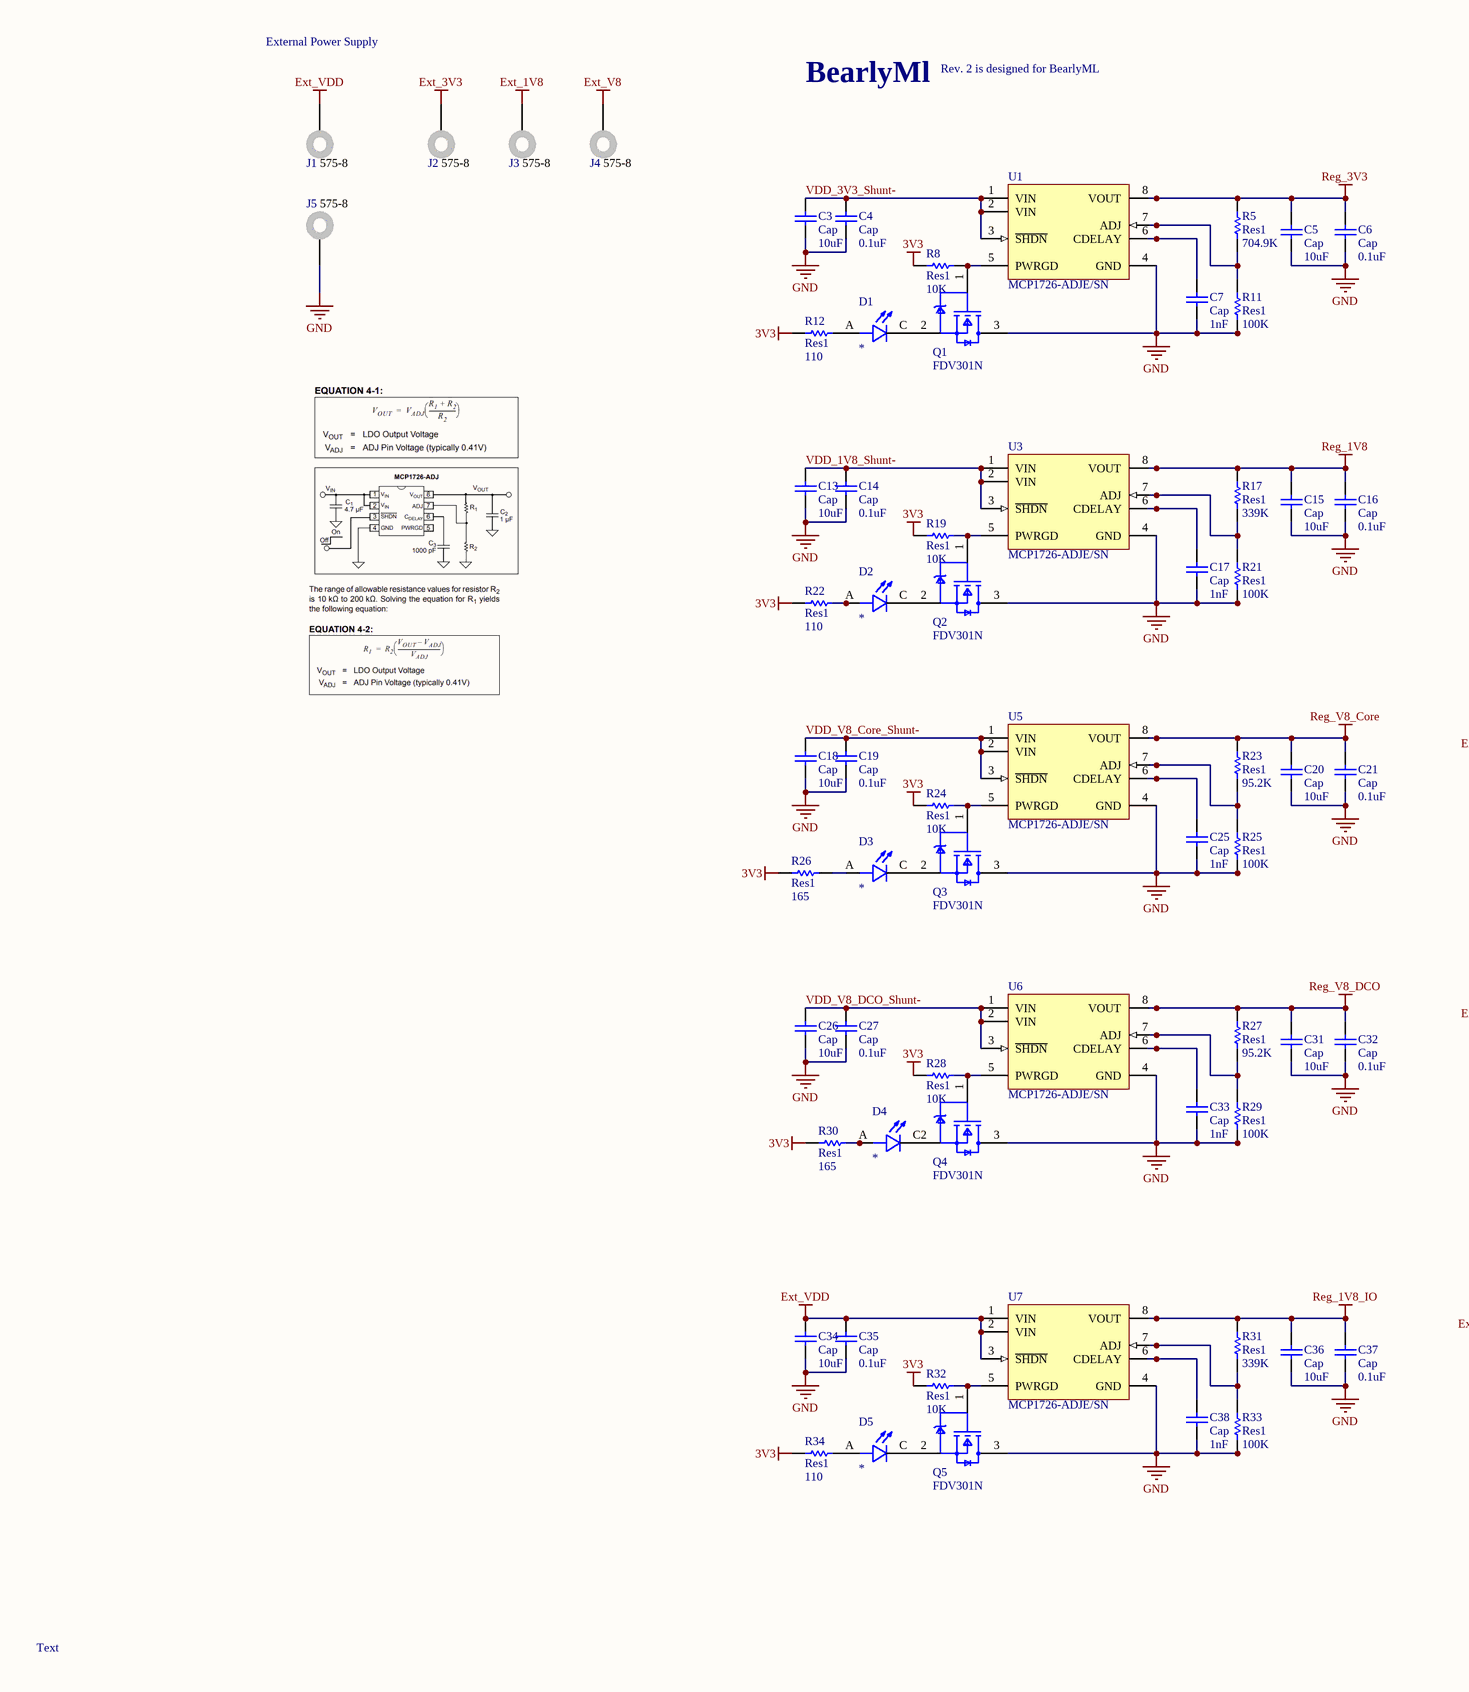
[diagram p5: Power.SchDoc, left]
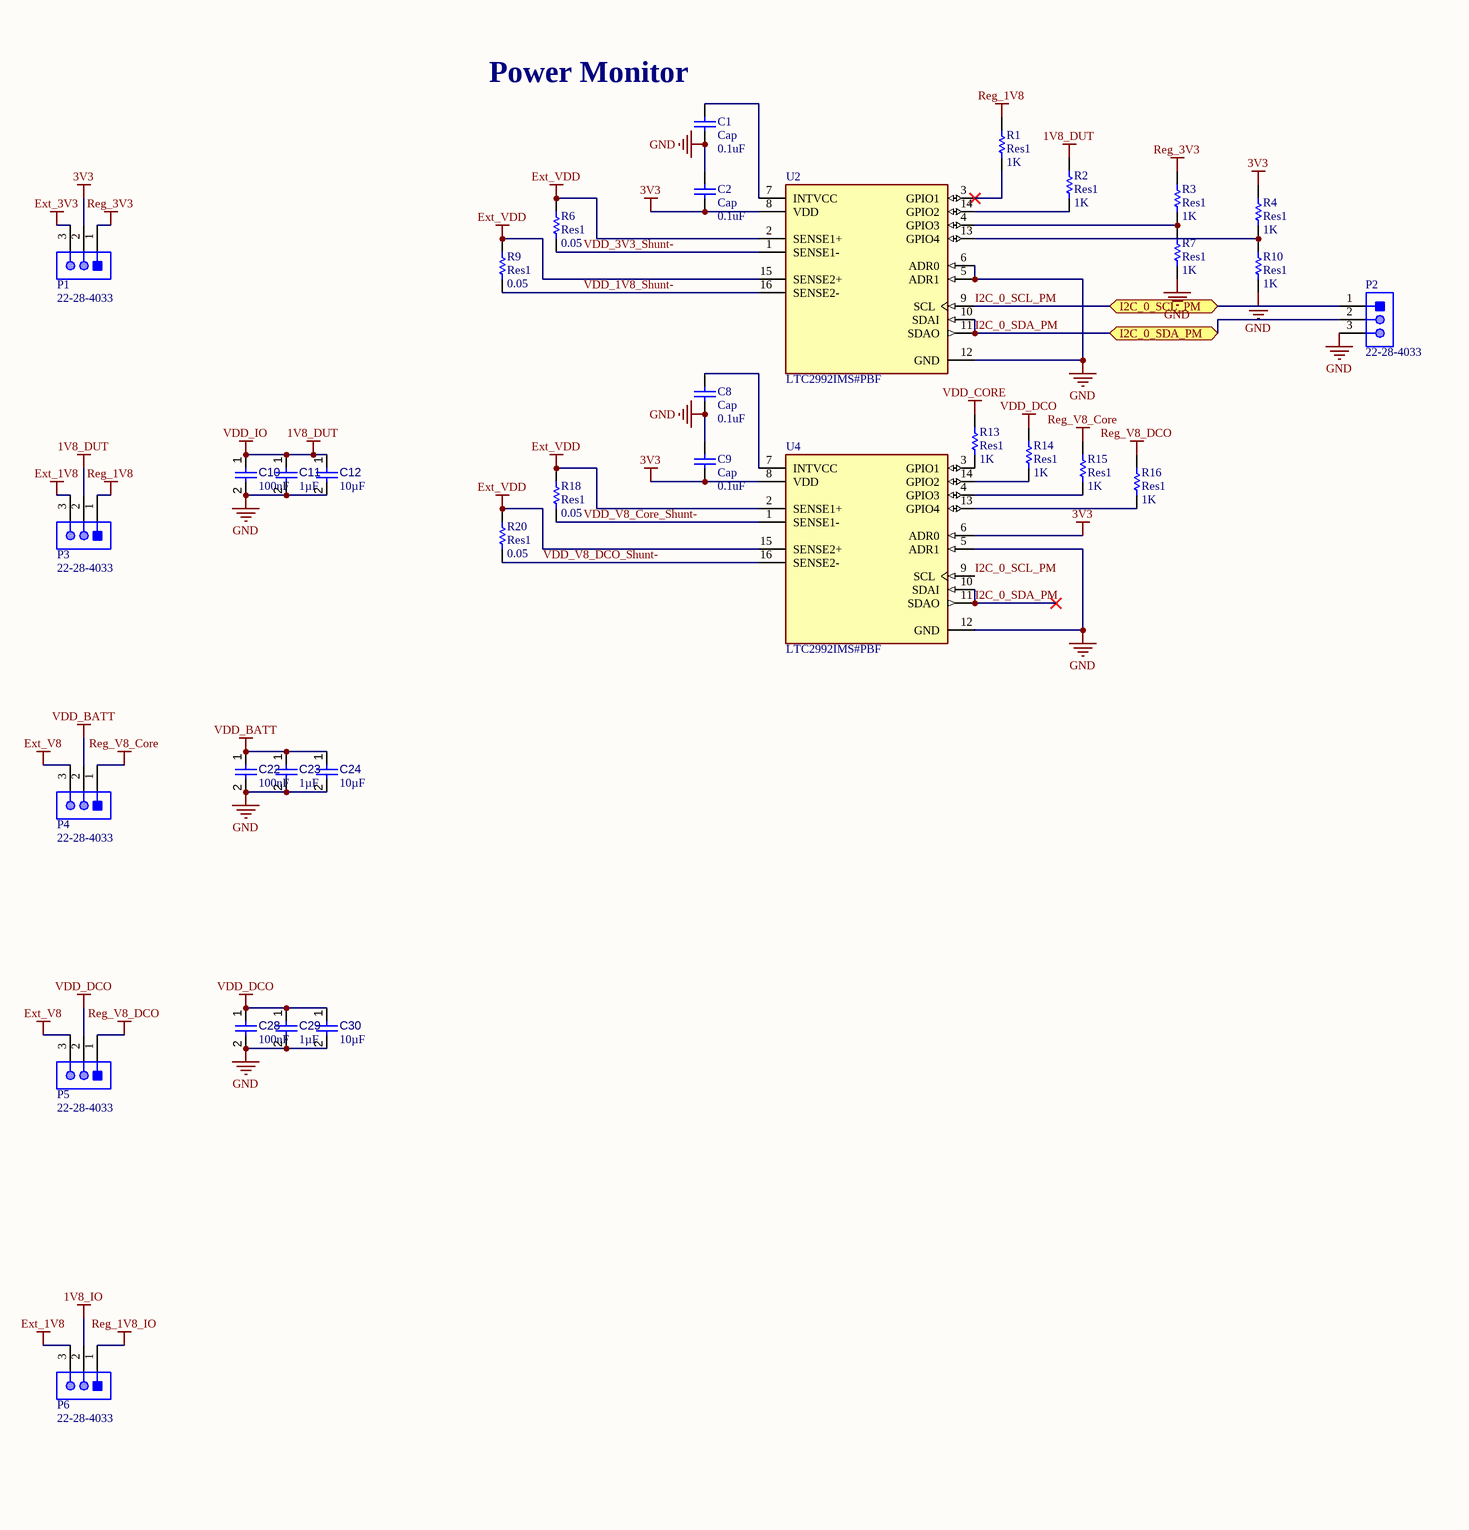
[diagram p6: Power.SchDoc, right]

### Parts
C1  Cap  value 0.1uF  [0603]
C2  Cap  value 0.1uF  [0603]
C3  Cap  value 10uF  [0805]
C4  Cap  value 0.1uF  [0603]
C5  Cap  value 10uF  [0805]
C6  Cap  value 0.1uF  [0603]
C7  Cap  value 1nF  [0603]
C8  Cap  value 0.1uF  [0603]
C9  Cap  value 0.1uF  [0603]
C10  value 100nF  [CAPC0402(1005)60_L]  (hidden comment: Capacitor 100nF +/-20% 10V 0402)
C11  value 1µF  [CAPC0402(1005)60_L]  (hidden comment: Capacitor 1µF +/-20% 10V 0402)
C12  value 10µF  [CAPC0402(1005)60_L]  (hidden comment: Capacitor 10µF +/-40% 6.3V 0402)
C13  Cap  value 10uF  [0805]
C14  Cap  value 0.1uF  [0603]
C15  Cap  value 10uF  [0805]
C16  Cap  value 0.1uF  [0603]
C17  Cap  value 1nF  [0603]
C18  Cap  value 10uF  [0805]
C19  Cap  value 0.1uF  [0603]
C20  Cap  value 10uF  [0805]
C21  Cap  value 0.1uF  [0603]
C22  value 100nF  [CAPC0402(1005)60_L]  (hidden comment: Capacitor 100nF +/-20% 10V 0402)
C23  value 1µF  [CAPC0402(1005)60_L]  (hidden comment: Capacitor 1µF +/-20% 10V 0402)
C24  value 10µF  [CAPC0402(1005)60_L]  (hidden comment: Capacitor 10µF +/-40% 6.3V 0402)
C25  Cap  value 1nF  [0603]
C26  Cap  value 10uF  [0805]
C27  Cap  value 0.1uF  [0603]
C28  value 100nF  [CAPC0402(1005)60_L]  (hidden comment: Capacitor 100nF +/-20% 10V 0402)
C29  value 1µF  [CAPC0402(1005)60_L]  (hidden comment: Capacitor 1µF +/-20% 10V 0402)
C30  value 10µF  [CAPC0402(1005)60_L]  (hidden comment: Capacitor 10µF +/-40% 6.3V 0402)
C31  Cap  value 10uF  [0805]
C32  Cap  value 0.1uF  [0603]
C33  Cap  value 1nF  [0603]
C34  Cap  value 10uF  [0805]
C35  Cap  value 0.1uF  [0603]
C36  Cap  value 10uF  [0805]
C37  Cap  value 0.1uF  [0603]
C38  Cap  value 1nF  [0603]
D1  LTW-C191DS5  [LED0603]  (value not drawn)
D2  LTW-C191DS5  [LED0603]  (value not drawn)
D3  LTW-C191DS5  [LED0603]  (value not drawn)
D4  LTW-C191DS5  [LED0603]  (value not drawn)
D5  LTW-C191DS5  [LED0603]  (value not drawn)
J1  575-8  [KSTN-575-8]
J2  575-8  [KSTN-575-8]
J3  575-8  [KSTN-575-8]
J4  575-8  [KSTN-575-8]
J5  575-8  [KSTN-575-8]
P1  22-28-4033  [MOLX-22-28-4033_V]
P2  22-28-4033  [MOLX-22-28-4033_V]
P3  22-28-4033  [MOLX-22-28-4033_V]
P4  22-28-4033  [MOLX-22-28-4033_V]
P5  22-28-4033  [MOLX-22-28-4033_V]
P6  22-28-4033  [MOLX-22-28-4033_V]
Q1  FDV301N  [FP-318-08-MFG]
Q2  FDV301N  [FP-318-08-MFG]
Q3  FDV301N  [FP-318-08-MFG]
Q4  FDV301N  [FP-318-08-MFG]
Q5  FDV301N  [FP-318-08-MFG]
R1  Res1  value 1K  [0603]
R2  Res1  value 1K  [0603]
R3  Res1  value 1K  [0603]
R4  Res1  value 1K  [0603]
R5  Res1  value 704.9K  [0603]
R6  Res1  value 0.05  [0603]
R7  Res1  value 1K  [0603]
R8  Res1  value 10K  [0603]
R9  Res1  value 0.05  [0603]
R10  Res1  value 1K  [0603]
R11  Res1  value 100K  [0603]
R12  Res1  value 110  [0603]
R13  Res1  value 1K  [0603]
R14  Res1  value 1K  [0603]
R15  Res1  value 1K  [0603]
R16  Res1  value 1K  [0603]
R17  Res1  value 339K  [0603]
R18  Res1  value 0.05  [0603]
R19  Res1  value 10K  [0603]
R20  Res1  value 0.05  [0603]
R21  Res1  value 100K  [0603]
R22  Res1  value 110  [0603]
R23  Res1  value 95.2K  [0603]
R24  Res1  value 10K  [0603]
R25  Res1  value 100K  [0603]
R26  Res1  value 165  [0603]
R27  Res1  value 95.2K  [0603]
R28  Res1  value 10K  [0603]
R29  Res1  value 100K  [0603]
R30  Res1  value 165  [0603]
R31  Res1  value 339K  [0603]
R32  Res1  value 10K  [0603]
R33  Res1  value 100K  [0603]
R34  Res1  value 110  [0603]
U1  MCP1726-ADJE/SN  [SOIC-SN8_N]
U2  LTC2992IMS#PBF  [FP-MS-16-05-08-1669-IPC_C]
U3  MCP1726-ADJE/SN  [SOIC-SN8_N]
U4  LTC2992IMS#PBF  [FP-MS-16-05-08-1669-IPC_C]
U5  MCP1726-ADJE/SN  [SOIC-SN8_N]
U6  MCP1726-ADJE/SN  [SOIC-SN8_N]
U7  MCP1726-ADJE/SN  [SOIC-SN8_N]

### Ports
I2C_0_SCL_PM (bidir), I2C_0_SDA_PM (bidir)

### Nets
1V8_DUT: C10.1 C11.1 C12.1 P3.2 R2.1  [also labelled VDD_IO]
1V8_IO: P6.2
3V3: C2.2 C9.2 P1.2 R4.1 R8.1 R12.1 R19.1 R22.1 R24.1 R26.1 R28.1 R30.1 R32.1 R34.1 U2.8(VDD) U4.6(ADR0) U4.8(VDD)
Ext_1V8: J3.1 P3.3 P6.3
Ext_3V3: J2.1 P1.3
Ext_V8: J4.1 P4.3 P5.3
Ext_VDD: C34.2 C35.2 J1.1 R6.2 R9.2 R18.2 R20.2 U2.2(SENSE1+) U2.15(SENSE2+) U4.2(SENSE1+) U4.15(SENSE2+) U7.1(VIN) U7.2(VIN) U7.3(~{SHDN})
GND: C1.2 C2.1 C3.1 C4.1 C5.1 C6.1 C7.1 C8.2 C9.1 C10.2 C11.2 C12.2 C13.1 C14.1 C15.1 C16.1 C17.1 C18.1 C19.1 C20.1 C21.1 C22.2 C23.2 C24.2 C25.1 C26.1 C27.1 C28.2 C29.2 C30.2 C31.1 C32.1 C33.1 C34.1 C35.1 C36.1 C37.1 C38.1 J5.1 P2.3 Q1.3(D) Q2.3(D) Q3.3(D) Q4.3(D) Q5.3(D) R7.2 R10.2 R11.1 R21.1 R25.1 R29.1 R33.1 U1.4(GND) U2.5(ADR1) U2.6(ADR0) U2.12(GND) U3.4(GND) U4.5(ADR1) U4.12(GND) U5.4(GND) U6.4(GND) U7.4(GND)
Reg_1V8: C15.2 C16.2 P3.1 R1.1 R17.2 U3.8(VOUT)
Reg_1V8_IO: C36.2 C37.2 P6.1 R31.2 U7.8(VOUT)
Reg_3V3: C5.2 C6.2 P1.1 R3.1 R5.2 U1.8(VOUT)
Reg_V8_Core: C20.2 C21.2 P4.1 R15.1 R23.2 U5.8(VOUT)
Reg_V8_DCO: C31.2 C32.2 P5.1 R16.1 R27.2 U6.8(VOUT)
VDD_BATT: C22.1 C23.1 C24.1 P4.2
VDD_CORE: R13.1
VDD_DCO: C28.1 C29.1 C30.1 P5.2 R14.1
I2C_0_SCL_PM: P2.1 U2.9(SCL) U4.9(SCL) ; port I2C_0_SCL_PM
I2C_0_SDA_PM: P2.2 U2.10(SDAI) U2.11(SDAO) U4.10(SDAI) U4.11(SDAO) ; port I2C_0_SDA_PM
VDD_1V8_Shunt-: C13.2 C14.2 R9.1 U2.16(SENSE2-) U3.1(VIN) U3.2(VIN) U3.3(~{SHDN})
VDD_3V3_Shunt-: C3.2 C4.2 R6.1 U1.1(VIN) U1.2(VIN) U1.3(~{SHDN}) U2.1(SENSE1-)
VDD_V8_Core_Shunt-: C18.2 C19.2 R18.1 U4.1(SENSE1-) U5.1(VIN) U5.2(VIN) U5.3(~{SHDN})
VDD_V8_DCO_Shunt-: C26.2 C27.2 R20.1 U4.16(SENSE2-) U6.1(VIN) U6.2(VIN) U6.3(~{SHDN})
NetC1_1: C1.1 U2.7(INTVCC)
NetC7_2: C7.2 U1.6(CDELAY)
NetC8_1: C8.1 U4.7(INTVCC)
NetC17_2: C17.2 U3.6(CDELAY)
NetC25_2: C25.2 U5.6(CDELAY)
NetC33_2: C33.2 U6.6(CDELAY)
NetC38_2: C38.2 U7.6(CDELAY)
NetD1_A: D1.A R12.2
NetD1_C: D1.C Q1.2(S)
NetD2_A: D2.A R22.2
NetD2_C: D2.C Q2.2(S)
NetD3_A: D3.A R26.2
NetD3_C: D3.C Q3.2(S)
NetD4_A: D4.A R30.2
NetD5_A: D5.A R34.2
NetD5_C: D5.C Q5.2(S)
NetQ1_1: Q1.1(G) R8.2 U1.5(PWRGD)
NetQ2_1: Q2.1(G) R19.2 U3.5(PWRGD)
NetQ3_1: Q3.1(G) R24.2 U5.5(PWRGD)
NetQ4_1: Q4.1(G) R28.2 U6.5(PWRGD)
NetQ5_1: Q5.1(G) R32.2 U7.5(PWRGD)
NetR1_2: R1.2 U2.3(GPIO1)
NetR2_2: R2.2 U2.14(GPIO2)
NetR3_2: R3.2 R7.1 U2.4(GPIO3)
NetR4_2: R4.2 R10.1 U2.13(GPIO4)
NetR5_1: R5.1 R11.2 U1.7(ADJ)
NetR13_2: R13.2 U4.3(GPIO1)
NetR14_2: R14.2 U4.14(GPIO2)
NetR15_2: R15.2 U4.4(GPIO3)
NetR16_2: R16.2 U4.13(GPIO4)
NetR17_1: R17.1 R21.2 U3.7(ADJ)
NetR23_1: R23.1 R25.2 U5.7(ADJ)
NetR27_1: R27.1 R29.2 U6.7(ADJ)
NetR31_1: R31.1 R33.2 U7.7(ADJ)

Not connected (* = marked no-connect by the designer): D4 C; Q4 2(S)

### Notes on the sheet
- External Power Supply
- Rev. 2 is designed for BearlyML
- BearlyMl
- (near C1) Power Monitor
- Text

### Library data of the parts
C1-C9 C13-C21 C25-C27 C31-C38 = Cap: Capacitor; Published: 8-Jun-2000; LatestRevisionDate: 17-Jul-2002; LatestRevisionNote: Re-released for DXP Platform.; PackageReference: RAD-0.3; Publisher: Altium Limited; PackageDescription: Radial Cap, Thru-Hole; 2 Leads; 0.3 in Pin Spacing
C10 C22 C28 = CMP-001-00061-3: Chip Capacitor, 100nF +/-20%, 10V, 0402, Thickness 0.6 mm; Tolerance: 20%; Mounting Technology: SMT; Voltage Rating: 10V; Max Operating Temperature: 85°C; Pins: 2; Case/Package: 0402; Min Operating Temperature: -55°C
C11 C23 C29 = CMP-001-00063-3: Chip Capacitor, 1µF +/-20%, 10V, 0402, Thickness 0.6 mm; Tolerance: 10%; Mounting Technology: SMT; Max Operating Temperature: 85°C; Voltage Rating: 10V; Pins: 2; Case/Package: 0402; Min Operating Temperature: -55°C
C12 C24 C30 = CMP-001-00074-3: Chip Capacitor, 10µF +/-40%, 6.3V, 0402, Thickness 0.6 mm; Tolerance: 10%; Case/Package: 0402; Pins: 2; Mounting Technology: SMT; Voltage Rating: 6.3V; Max Operating Temperature: 85°C; Min Operating Temperature: -55°C
D1-D5 = CMP-022-000000-2: White LED Indication - Discrete 2.93V 0603 _1608 Metric_; MF: Lite-On Inc.; Price: None; MP: LTW-C191DS5; Design Item ID: LTW-C191DS5; Availability: Unavailable; SnapEDA_Link: https://www.snapeda.com/parts/LTW-C191DS5/Lite-On%20Inc./view-part/199753/?ref=snap; Value: *; Source: SnapEDAsch.SchLib; Pin Count: 2; Component Type: Standard; Package: 0603 Lite-On
J1-J5 = CMP-1672-00007-5: Non-Insulated Jack, Through Hole, RoHS, Bulk; Manufacturer: Keystone; PackageDescription: 1-Pin Through Hole Device, Dia 7.92 mm; PackageReference: 575-8; ComponentLink1Description: Manufacturer URL; Mounting Technology: Through Hole; ComponentLink2URL: http://www.keyelco.com/product-pdf.cfm?p=2379; ComponentLink2Description: Datasheet; DatasheetVersion: Rev. B, 11/1994; ComponentLink1URL: http://www.keyelco.com/
P1-P6 = CMP-1676-00001-5: as P26 on sheet DUT; Min Operating Temperature: 0 degC; Lead Pitch: 0.1 inch; Packaging: Bulk; Contact Finish: Gold; RoHSCompliant: true; Contact Material: Brass; PackageReference: 22-28-4033; REACH SVHC: Unknown; PackageDescription: Male Header, Pitch 2.54 mm, 1 x 3 Position, Height 8.38 mm, Tail Length 3.18 mm; ComponentLink2URL: http://www.molex.com/pdm_docs/sd/022284033_sd.pdf; Height: 8.38 mm; Mounting Technology: Through Hole; ComponentLink1Description: Manufacturer URL; Length: 7.62 mm; Mount: Through Hole; DatasheetVersion: Rev. G, 01/2012; Max Operating Temperature: 75 degC; ComponentLink2Description: Datasheet; Colour: Black; Pins: 3; Contact Plating: Gold; Package Quantity: 1; ComponentLink1URL: http://www.molex.com/
Q1-Q5 = CMP-2000-04935-2: MOSFET N-CH 25V 220MA SOT-23; Manufacturer: ON Semiconductor; Turn Off Delay Time: 3.5ns; Typ Forward Diode Voltage: 0.8V; Max Junction Temp: +150°C; Threshold Vgs Max: 1.06V; Threshold Vgs Min: 0.7V; Standoff Height: 0.01mm; Max Forward Diode Voltage: 1.2V; Number Of Channels: 1; Rthja Max: 357°C/W; Drain To Source Resistance: 3.1Ω; Input Capacitace At Vds: 9.5pF @ 10V; Gate Charge At Vgs: 0.49nC @ 4.5V; Transconductance: 0.2S; Turn On Delay Time: 3.2ns; Depletion Mode: False; Power Dissipation: 0.35W; Continuous Drain Current: 0.22A; Gate To Source Voltage: 8V; RoHS: TRUE; Lead Free: Yes; Temperature Range High: +150°C; Automotive: No; Height: 1.11mm; Category: Trans; Mouser Description: MOSFET N-Ch Digital; Drain To Source Voltage: 25V; Temperature: -55°C to +150°C; Ipc Land Pattern Name: SOT95P240X100-3; Device Class L1: Discrete Semiconductors; Octopart: https://octopart.com/fdv301n-on+semiconductor-84326713; Footprint Url: https://www.onsemi.com/pub/Collateral/318-08.PDF; Digikey Description: MOSFET N-CH 25V 220MA SOT-23; Drain To Source Breakdown Voltage: 25V; Temperature Range Low: -55°C; Number Of N Channels: 1; Device Class L3: MOSFETs; Package: 318-08; ComponentLink2URL: https://www.onsemi.com/pub/Collateral/FDV301N-D.PDF; Manufacturer Part Number: FDV301N; Device Class L2: Transistors; ComponentLink2Description: Datasheet
R1-R34 = Res1: Resistor; Published: 8-Jun-2000; LatestRevisionDate: 17-Jul-2002; LatestRevisionNote: Re-released for DXP Platform.; PackageReference: AXIAL-0.3; Publisher: Altium Limited; PackageDescription: Axial Device, Thru-Hole; 2 Leads; 0.3 in Pin Spacing
U1 U3 U5-U7 = CMP-0136-00180-1: 1A, Low Voltage, Low Quiescent Current LDO Regulator, 8-Pin SOIC 150mil, Extended Temperature; Code_IPC: SOIC127P600-8; DatasheetVersion: revC, Aug-2007; PackageVersion: revBB, Aug-2009; Code_JEDEC: MS-012; PackageDescription: 8-Lead Plastic Small Outline (SN) - Narrow, 3.90mm Body [SOIC]; PackageReference: SOIC-SN8
U2 U4 = CMP-09131-000077-1: IC PWR MONITOR DUAL WIDE 16MSOP; RoHS Compliant: Yes

## Sheet IO.SchDoc
size A2; SPICEModelCacheUFEYCXMP: <root> / <DocumentId>UFEYCXMP</DocumentId> / </root>
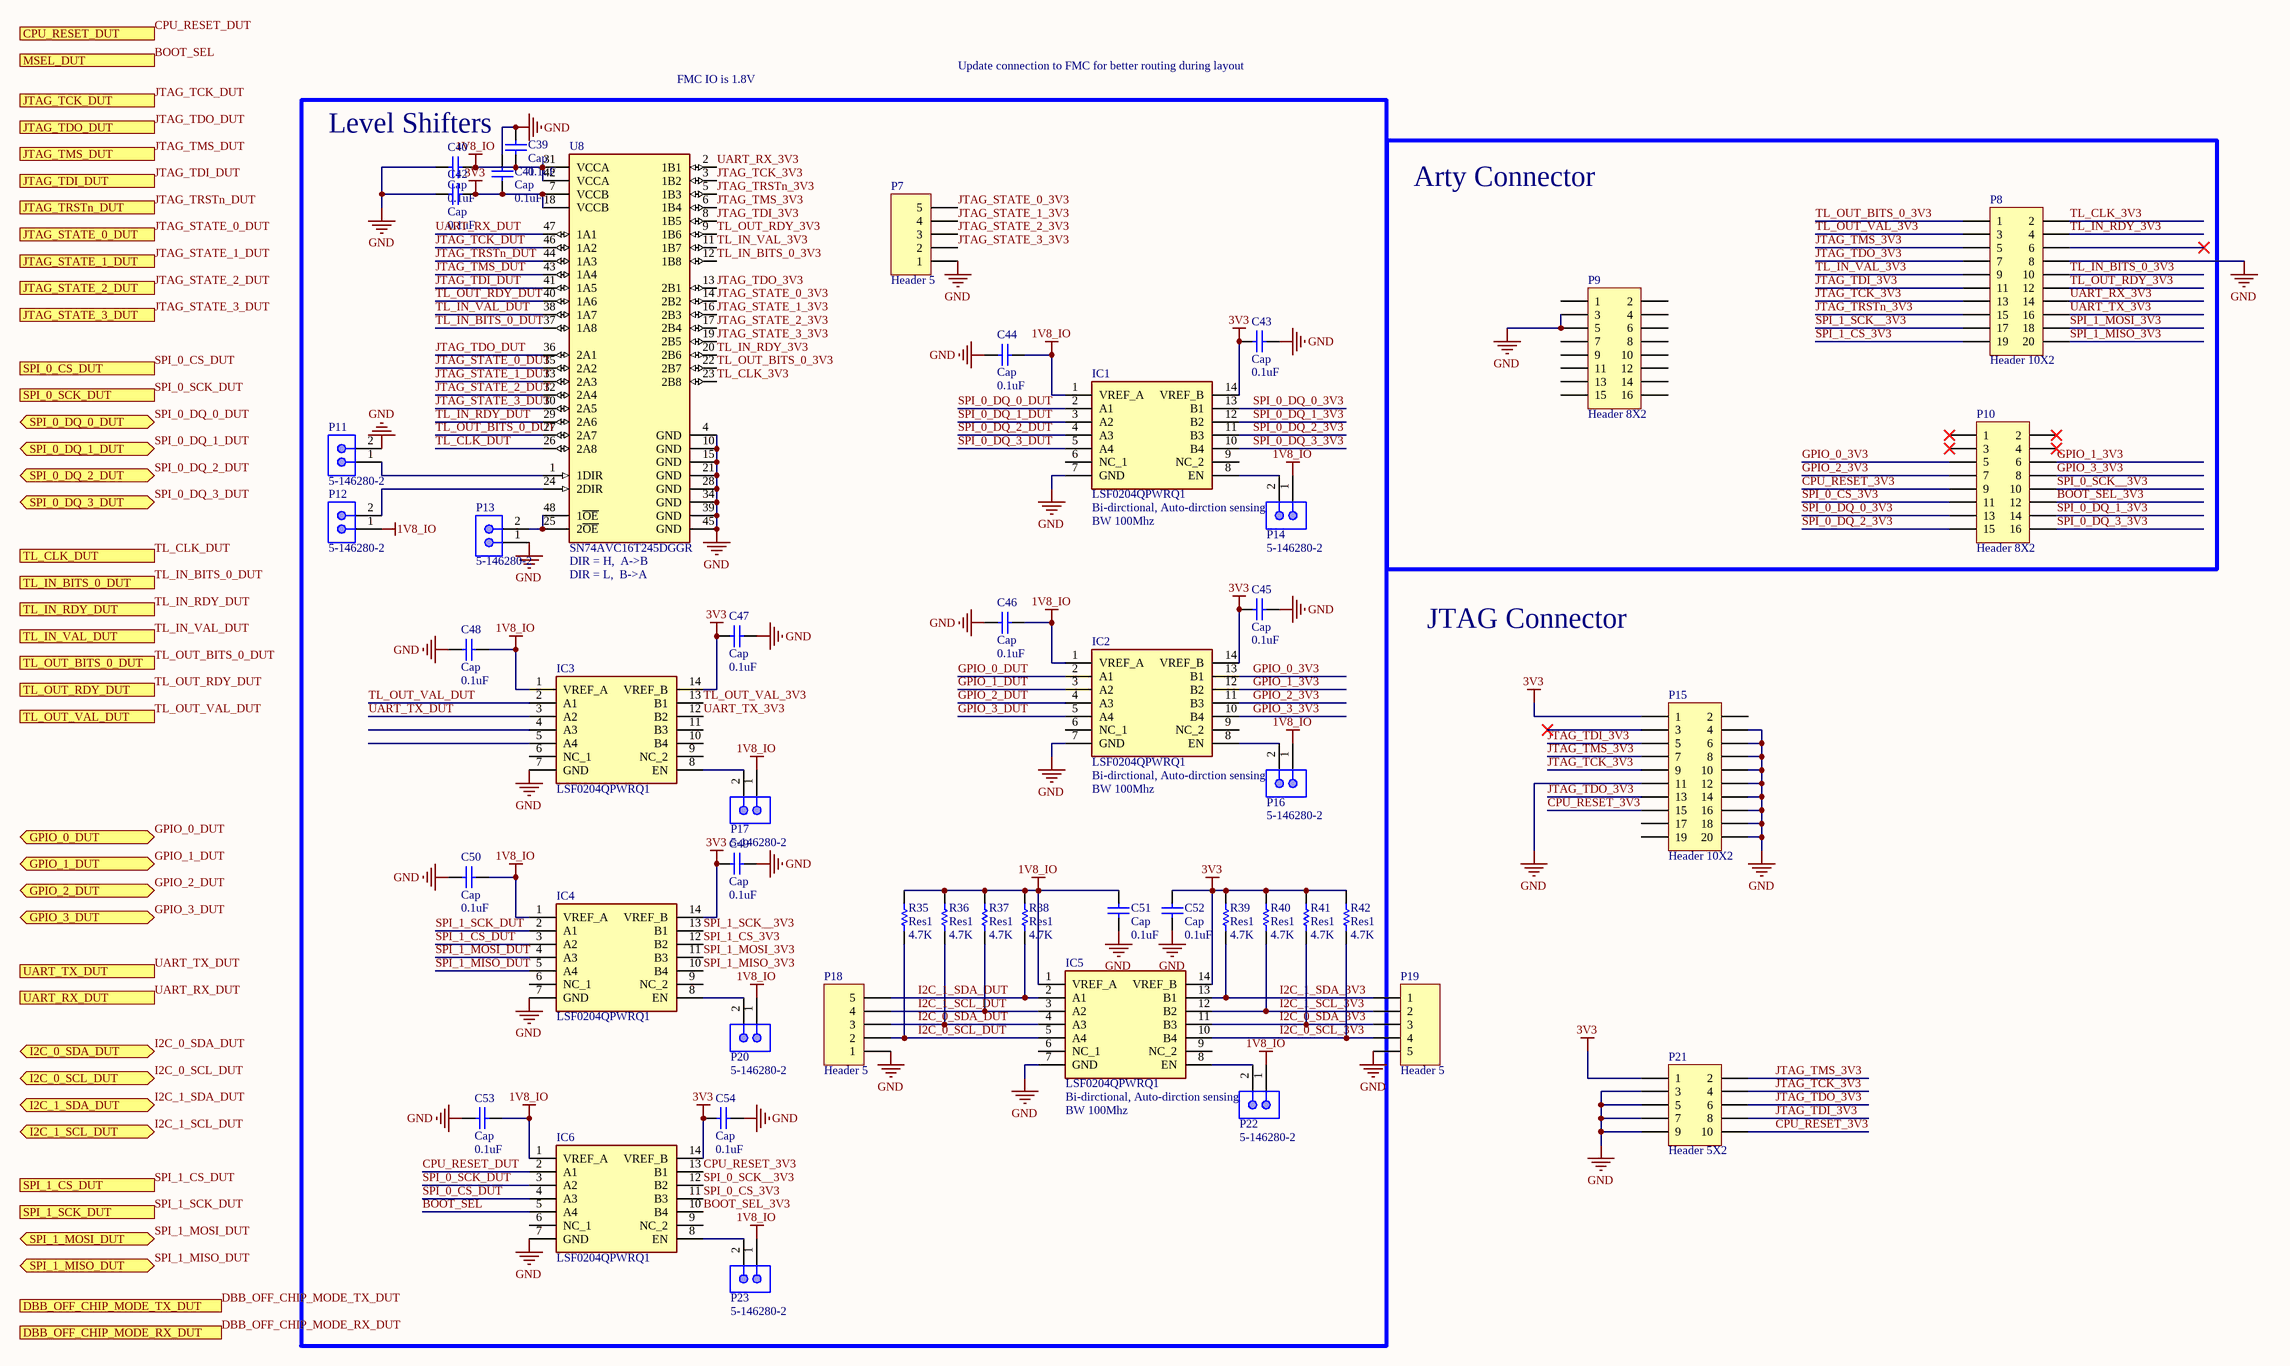
[diagram p7: IO.SchDoc]

### Parts
C39  Cap  value 0.1uF  [0603]
C40  Cap  value 0.1uF  [0603]
C41  Cap  value 0.1uF  [0603]
C42  Cap  value 0.1uF  [0603]
C43  Cap  value 0.1uF  [0603]
C44  Cap  value 0.1uF  [0603]
C45  Cap  value 0.1uF  [0603]
C46  Cap  value 0.1uF  [0603]
C47  Cap  value 0.1uF  [0603]
C48  Cap  value 0.1uF  [0603]
C49  Cap  value 0.1uF  [0603]
C50  Cap  value 0.1uF  [0603]
C51  Cap  value 0.1uF  [0603]
C52  Cap  value 0.1uF  [0603]
C53  Cap  value 0.1uF  [0603]
C54  Cap  value 0.1uF  [0603]
IC1  LSF0204QPWRQ1  [SOP65P640X120-14N]
IC2  LSF0204QPWRQ1  [SOP65P640X120-14N]
IC3  LSF0204QPWRQ1  [SOP65P640X120-14N]
IC4  LSF0204QPWRQ1  [SOP65P640X120-14N]
IC5  LSF0204QPWRQ1  [SOP65P640X120-14N]
IC6  LSF0204QPWRQ1  [SOP65P640X120-14N]
P7  Header 5  [HDR1X5]
P8  Header 10X2  [HDR2X10]
P9  Header 8X2  [HDR2X8]
P10  Header 8X2  [HDR2X8]
P11  5-146280-2  [TECO-5-146280-2_V]
P12  5-146280-2  [TECO-5-146280-2_V]
P13  5-146280-2  [TECO-5-146280-2_V]
P14  5-146280-2  [TECO-5-146280-2_V]
P15  Header 10X2  [HDR2X10]
P16  5-146280-2  [TECO-5-146280-2_V]
P17  5-146280-2  [TECO-5-146280-2_V]
P18  Header 5  [HDR1X5]
P19  Header 5  [HDR1X5]
P20  5-146280-2  [TECO-5-146280-2_V]
P21  Header 5X2  [HDR2X5]
P22  5-146280-2  [TECO-5-146280-2_V]
P23  5-146280-2  [TECO-5-146280-2_V]
R35  Res1  value 4.7K  [0603]
R36  Res1  value 4.7K  [0603]
R37  Res1  value 4.7K  [0603]
R38  Res1  value 4.7K  [0603]
R39  Res1  value 4.7K  [0603]
R40  Res1  value 4.7K  [0603]
R41  Res1  value 4.7K  [0603]
R42  Res1  value 4.7K  [0603]
U8  SN74AVC16T245DGGR  [FP-DGG0048A-IPC_B]

### Blocks framed on the sheet
Level Shifters: C39-C54 IC1-IC6 P7 P11-P14 P16-P18 P20 P22 P23 R35-R42 U8
Arty Connector: P8-P10

### Ports
CPU_RESET_DUT (out), DBB_OFF_CHIP_MODE_RX_DUT (in), DBB_OFF_CHIP_MODE_TX_DUT (in), GPIO_0_DUT (bidir), GPIO_1_DUT (bidir), GPIO_2_DUT (bidir), GPIO_3_DUT (bidir), I2C_0_SCL_DUT (bidir), I2C_0_SDA_DUT (bidir), I2C_1_SCL_DUT (bidir), I2C_1_SDA_DUT (bidir), JTAG_STATE_0_DUT (in), JTAG_STATE_1_DUT (in), JTAG_STATE_2_DUT (in), JTAG_STATE_3_DUT (in), JTAG_TCK_DUT (out), JTAG_TDI_DUT (out), JTAG_TDO_DUT (in), JTAG_TMS_DUT (out), JTAG_TRSTn_DUT (out), MSEL_DUT (out), SPI_0_CS_DUT (in), SPI_0_DQ_0_DUT (bidir), SPI_0_DQ_1_DUT (bidir), SPI_0_DQ_2_DUT (bidir), SPI_0_DQ_3_DUT (bidir), SPI_0_SCK_DUT (in), SPI_1_CS_DUT (in), SPI_1_MISO_DUT (bidir), SPI_1_MOSI_DUT (bidir), SPI_1_SCK_DUT (in), TL_CLK_DUT (in), TL_IN_BITS_0_DUT (out), TL_IN_RDY_DUT (in), TL_IN_VAL_DUT (out), TL_OUT_BITS_0_DUT (in), TL_OUT_RDY_DUT (out), TL_OUT_VAL_DUT (in), UART_RX_DUT (out), UART_TX_DUT (in)

### Nets
1V8_IO: C39.2 C40.1 C44.1 C46.1 C48.1 C50.1 C51.2 C53.1 IC1.1(VREF_A) IC2.1(VREF_A) IC3.1(VREF_A) IC4.1(VREF_A) IC5.1(VREF_A) IC6.1(VREF_A) P12.1 P14.1 P16.1 P17.1 P20.1 P22.1 P23.1 R35.2 R36.2 R37.2 R38.2 U8.31(VCCA) U8.42(VCCA)
3V3: C41.2 C42.1 C43.2 C45.2 C47.2 C49.2 C52.2 C54.2 IC1.14(VREF_B) IC2.14(VREF_B) IC3.14(VREF_B) IC4.14(VREF_B) IC5.14(VREF_B) IC6.14(VREF_B) P15.1 P21.1 R39.2 R40.2 R41.2 R42.2 U8.7(VCCB) U8.18(VCCB)
GND: C39.1 C40.2 C41.1 C42.2 C43.1 C44.2 C45.1 C46.2 C47.1 C48.2 C49.1 C50.2 C51.1 C52.1 C53.2 C54.1 IC1.7(GND) IC2.7(GND) IC3.7(GND) IC4.7(GND) IC5.7(GND) IC6.7(GND) P7.1 P8.8 P9.3 P9.5 P11.2 P13.1 P15.4 P15.6 P15.8 P15.10 P15.11 P15.12 P15.14 P15.16 P15.18 P15.20 P18.1 P19.5 P21.3 P21.5 P21.7 P21.9 U8.4(GND) U8.10(GND) U8.15(GND) U8.21(GND) U8.28(GND) U8.34(GND) U8.39(GND) U8.45(GND)
BOOT_SEL: IC6.5(A4) ; port MSEL_DUT
BOOT_SEL_3V3: IC6.10(B4) P10.12
CPU_RESET_3V3: IC6.13(B1) P10.9 P15.15 P21.10
CPU_RESET_DUT: IC6.2(A1) ; port CPU_RESET_DUT  [project net CPU_RESET]
GPIO_0_3V3: IC2.13(B1) P10.5
GPIO_0_DUT: IC2.2(A1) ; port GPIO_0_DUT  [project net GPIO_0]
GPIO_1_3V3: IC2.12(B2) P10.6
GPIO_1_DUT: IC2.3(A2) ; port GPIO_1_DUT  [project net GPIO_1]
GPIO_2_3V3: IC2.11(B3) P10.7
GPIO_2_DUT: IC2.4(A3) ; port GPIO_2_DUT  [project net GPIO_2]
GPIO_3_3V3: IC2.10(B4) P10.8
GPIO_3_DUT: IC2.5(A4) ; port GPIO_3_DUT  [project net GPIO_3]
I2C_0_SCL_3V3: IC5.10(B4) P19.4 R42.1
I2C_0_SCL_DUT: IC5.5(A4) P18.2 R35.1 ; port I2C_0_SCL_DUT  [project net I2C_0_SCL]
I2C_0_SDA_3V3: IC5.11(B3) P19.3 R41.1
I2C_0_SDA_DUT: IC5.4(A3) P18.3 R36.1 ; port I2C_0_SDA_DUT  [project net I2C_0_SDA]
I2C_1_SCL_3V3: IC5.12(B2) P19.2 R40.1
I2C_1_SCL_DUT: IC5.3(A2) P18.4 R37.1 ; port I2C_1_SCL_DUT  [project net I2C_1_SCL]
I2C_1_SDA_3V3: IC5.13(B1) P19.1 R39.1
I2C_1_SDA_DUT: IC5.2(A1) P18.5 R38.1 ; port I2C_1_SDA_DUT  [project net I2C_1_SDA]
JTAG_STATE_0_3V3: P7.5 U8.14(2B2)
JTAG_STATE_0_DUT: U8.35(2A2) ; port JTAG_STATE_0_DUT  [project net JTAG_STATE_0]
JTAG_STATE_1_3V3: P7.4 U8.16(2B3)
JTAG_STATE_1_DUT: U8.33(2A3) ; port JTAG_STATE_1_DUT  [project net JTAG_STATE_1]
JTAG_STATE_2_3V3: P7.3 U8.17(2B4)
JTAG_STATE_2_DUT: U8.32(2A4) ; port JTAG_STATE_2_DUT  [project net JTAG_STATE_2]
JTAG_STATE_3_3V3: P7.2 U8.19(2B5)
JTAG_STATE_3_DUT: U8.30(2A5) ; port JTAG_STATE_3_DUT  [project net JTAG_STATE_3]
JTAG_TCK_3V3: P8.13 P15.9 P21.4 U8.3(1B2)
JTAG_TCK_DUT: U8.46(1A2) ; port JTAG_TCK_DUT  [project net JTAG_TCK]
JTAG_TDI_3V3: P8.11 P15.5 P21.8 U8.8(1B5)
JTAG_TDI_DUT: U8.41(1A5) ; port JTAG_TDI_DUT  [project net JTAG_TDI]
JTAG_TDO_3V3: P8.7 P15.13 P21.6 U8.13(2B1)
JTAG_TDO_DUT: U8.36(2A1) ; port JTAG_TDO_DUT  [project net JTAG_TDO]
JTAG_TMS_3V3: P8.5 P15.7 P21.2 U8.6(1B4)
JTAG_TMS_DUT: U8.43(1A4) ; port JTAG_TMS_DUT  [project net JTAG_TMS]
JTAG_TRSTn_3V3: P8.15 U8.5(1B3)
JTAG_TRSTn_DUT: U8.44(1A3) ; port JTAG_TRSTn_DUT  [project net JTAG_TRST]
SPI_0_CS_3V3: IC6.11(B3) P10.11
SPI_0_CS_DUT: IC6.4(A3) ; port SPI_0_CS_DUT  [project net SPI_0_CS]
SPI_0_DQ_0_3V3: IC1.13(B1) P10.13
SPI_0_DQ_0_DUT: IC1.2(A1) ; port SPI_0_DQ_0_DUT
SPI_0_DQ_1_3V3: IC1.12(B2) P10.14
SPI_0_DQ_1_DUT: IC1.3(A2) ; port SPI_0_DQ_1_DUT
SPI_0_DQ_2_3V3: IC1.11(B3) P10.15
SPI_0_DQ_2_DUT: IC1.4(A3) ; port SPI_0_DQ_2_DUT
SPI_0_DQ_3_3V3: IC1.10(B4) P10.16
SPI_0_DQ_3_DUT: IC1.5(A4) ; port SPI_0_DQ_3_DUT
SPI_0_SCK__3V3: IC6.12(B2) P10.10
SPI_0_SCK_DUT: IC6.3(A2) ; port SPI_0_SCK_DUT  [project net SPI_0_SCK]
SPI_1_CS_3V3: IC4.12(B2) P8.19
SPI_1_CS_DUT: IC4.3(A2) ; port SPI_1_CS_DUT  [project net SPI_1_CS]
SPI_1_MISO_3V3: IC4.10(B4) P8.20
SPI_1_MISO_DUT: IC4.5(A4) ; port SPI_1_MISO_DUT  [project net SPI_1_MISO]
SPI_1_MOSI_3V3: IC4.11(B3) P8.18
SPI_1_MOSI_DUT: IC4.4(A3) ; port SPI_1_MOSI_DUT  [project net SPI_1_MOSI]
SPI_1_SCK__3V3: IC4.13(B1) P8.17
SPI_1_SCK_DUT: IC4.2(A1) ; port SPI_1_SCK_DUT  [project net SPI_1_SCK]
TL_CLK_3V3: P8.2 U8.23(2B8)
TL_CLK_DUT: U8.26(2A8) ; port TL_CLK_DUT  [project net TL_CLK]
TL_IN_BITS_0_3V3: P8.10 U8.12(1B8)
TL_IN_BITS_0_DUT: U8.37(1A8) ; port TL_IN_BITS_0_DUT
TL_IN_RDY_3V3: P8.4 U8.20(2B6)
TL_IN_RDY_DUT: U8.29(2A6) ; port TL_IN_RDY_DUT  [project net TL_IN_RDY]
TL_IN_VAL_3V3: P8.9 U8.11(1B7)
TL_IN_VAL_DUT: U8.38(1A7) ; port TL_IN_VAL_DUT  [project net TL_IN_VAL]
TL_OUT_BITS_0_3V3: P8.1 U8.22(2B7)
TL_OUT_BITS_0_DUT: U8.27(2A7) ; port TL_OUT_BITS_0_DUT
TL_OUT_RDY_3V3: P8.12 U8.9(1B6)
TL_OUT_RDY_DUT: U8.40(1A6) ; port TL_OUT_RDY_DUT  [project net TL_OUT_RDY]
TL_OUT_VAL_3V3: IC3.13(B1) P8.3
TL_OUT_VAL_DUT: IC3.2(A1) ; port TL_OUT_VAL_DUT  [project net TL_OUT_VAL]
UART_RX_3V3: P8.14 U8.2(1B1)
UART_RX_DUT: U8.47(1A1) ; port UART_RX_DUT  [project net UART_RX]
UART_TX_3V3: IC3.12(B2) P8.16
UART_TX_DUT: IC3.3(A2) ; port UART_TX_DUT  [project net UART_TX]
NetIC1_8: IC1.8(EN) P14.2
NetIC2_8: IC2.8(EN) P16.2
NetIC3_8: IC3.8(EN) P17.2
NetIC4_8: IC4.8(EN) P20.2
NetIC5_8: IC5.8(EN) P22.2
NetIC6_8: IC6.8(EN) P23.2
NetP11_1: P11.1 U8.1(1DIR)
NetP12_2: P12.2 U8.24(2DIR)
NetP13_2: P13.2 U8.25(2~{OE}) U8.48(1~{OE})

Not connected (* = marked no-connect by the designer): IC1 6(NC_1) 9(NC_2); IC2 6(NC_1) 9(NC_2); IC3 4(A3) 5(A4) 6(NC_1) 9(NC_2) 10(B4) 11(B3); IC4 6(NC_1) 9(NC_2); IC5 6(NC_1) 9(NC_2); IC6 6(NC_1) 9(NC_2); P8 6*; P9 1 2 4 6 7 8 9 10 11 12 13 14 15 16; P10 1* 2* 3* 4*; P15 2 3* 17 19

### Notes on the sheet
- FMC IO is 1.8V
- Update connection to FMC for better routing during layout
- (near U8) DIR = H,  A->B
- (near P14) Bi-dirctional, Auto-dirction sensing
- (near IC1) BW 100Mhz
- (near U8) DIR = L,  B->A
- JTAG Connector
- (near P16) Bi-dirctional, Auto-dirction sensing
- (near IC2) BW 100Mhz
- (near P22) Bi-dirctional, Auto-dirction sensing
- (near IC5) BW 100Mhz

### Library data of the parts
C39-C54 = Cap: Capacitor; Published: 8-Jun-2000; LatestRevisionDate: 17-Jul-2002; LatestRevisionNote: Re-released for DXP Platform.; PackageReference: RAD-0.3; Publisher: Altium Limited; PackageDescription: Radial Cap, Thru-Hole; 2 Leads; 0.3 in Pin Spacing
IC1-IC6 = CMP-016-000005-1: Automotive 4-Bit Bidirectional Multi-Voltage Level Translator for Open-Drain or Push- Pull Interface; Manufacturer_Name: Texas Instruments; Manufacturer_Part_Number: LSF0204QPWRQ1; Mouser Part Number: 595-LSF0204QPWRQ1; Arrow Part Number: LSF0204QPWRQ1; Design Item ID: LSF0204QPWRQ1; Datasheet Link: http://www.ti.com/lit/gpn/lsf0204-q1; Height: 1.2mm; Mouser Price/Stock: https://www.mouser.co.uk/ProductDetail/Texas-Instruments/LSF0204QPWRQ1?qs=w%2Fv1CP2dgqqt88p%2F1xId1A%3D%3D; Source: SamacSys.SchLib; Arrow Price/Stock: https://www.arrow.com/en/products/lsf0204qpwrq1/texas-instruments?region=nac
P7 P18 P19 = Header 5: Header, 5-Pin; LatestRevisionDate: 17-Jul-2002; LatestRevisionNote: Re-released for DXP Platform.; Publisher: Altium Limited
P8 P15 = Header 10X2: Header, 10-Pin, Dual row; LatestRevisionDate: 17-Jul-2002; LatestRevisionNote: Re-released for DXP Platform.; Publisher: Altium Limited
P9 P10 = Header 8X2: Header, 8-Pin, Dual row; LatestRevisionDate: 17-Jul-2002; LatestRevisionNote: Re-released for DXP Platform.; Publisher: Altium Limited
P11-P14 P16 P17 P20 P22 P23 = CMP-2000-07492-1: Male Header, Pitch 2.54 mm, 1 x 2 Position, Height 8.21 mm, Tail Length 3.05 mm, -65 to 105 degC, RoHS, Bulk; Manufacturer: TE Connectivity; Mating Connector Lock: No(Without); Number of Positions: 2; Pitch: 2.54mm; PCB Mounting Orientation: Vertical; Keyed: No; Case\/Package: 100; Mating Post Length: 0.23inch; High Temperature Housing: Yes; Max Current Rating: 5A; PCB Thickness: 0.063inch; PCB Mount Retention: Without; Approvals: CSA; Current Rating: 3A; Radiation Hardening: No; Length: 4.67mm; Contact Mating Length: 0.23inch; Connector Type: Header; Number of Rows: 1; Termination Post Length: 0.12inch; Board Standoff: No(Without); Max Operating Temperature: 105degC; Contact Shape: Square; Selectively Loaded: No(Without); Gasket: No(Without); Number of Contacts: 2; Contact Gender: Male; Mating Alignment: No(Without); Manufacturer URL: http://www.te.com/; Datasheet URL: http://www.te.com/commerce/DocumentDelivery/DDEController?Action=showdoc&DocId=Customer+Drawing%7F146280%7FH1%7Fpdf%7FEnglish%7FENG_CD_146280_H1.pdf%7F5-146280-2; Mount: ThroughHole; Orientation: Straight; Packaging: Carton; Package Reference: 5-146280-2; Package Quantity: 500; Stabilizers: No(Without); Row Spacing: 2.54mm; Contact Material: CopperAlloy; Panel Mount Retention: No(Without); Datasheet Version: Rev. H1, 08/2016; Housing Colour: Black; Colour: Black; Package Description: Male Header, Pitch 2.54 mm, 1 x 2 Position, Height 8.21 mm, Tail Length 3.05 mm; Contact Plating: Matte; Housing Material: Polymer; Contact Protection: No(Without); Min Operating Temperature: -65degC; Mounting Technology: ThroughHole; Flammability Rating: UL94V-0; RoHSCompliant: true; Termination: ThroughHole; Depth: 2.34mm; High Speed Serial Data Connector: No
P21 = Header 5X2: Header, 5-Pin, Dual row; LatestRevisionDate: 17-Jul-2002; LatestRevisionNote: Re-released for DXP Platform.; Publisher: Altium Limited
R35-R42 = Res1: Resistor; Published: 8-Jun-2000; LatestRevisionDate: 17-Jul-2002; LatestRevisionNote: Re-released for DXP Platform.; PackageReference: AXIAL-0.3; Publisher: Altium Limited; PackageDescription: Axial Device, Thru-Hole; 2 Leads; 0.3 in Pin Spacing
U8 = CMP-04899-000056-1: IC TRNSLTR BIDIRECTIONAL 48TSSOP; Max Supply Voltage: 3.6V; Min Supply Voltage: 1.2V; Number of Channels: 2; Turn-On Delay Time: 5ns; Data Rate: 380Mbps; Logic Function: Translator; High Level Output Current: -12mA; Propagation Delay: 2.7ns; Polarity: Non-Inverting; Low Level Output Current: 12mA; Number of Bits: 16; Package Quantity: 1; Case/Package: TSSOP; Contact Plating: Gold; Length: 12.6mm; Number of Elements: 2; Mount: Surface Mount; Weight: 0.007873oz; Lead Free: Lead Free; Width: 6.2mm; Number of Pins: 48; Direction: Bidirectional; Min Operating Temperature: -40°C; REACH SVHC: No SVHC; Packaging: Tape and Reel; Max Operating Temperature: 85°C; Height: 1.05mm; RoHS Compliant: Yes; Radiation Hardening: No